# EAGLE design meteo_stm (EAGLE 6.4)
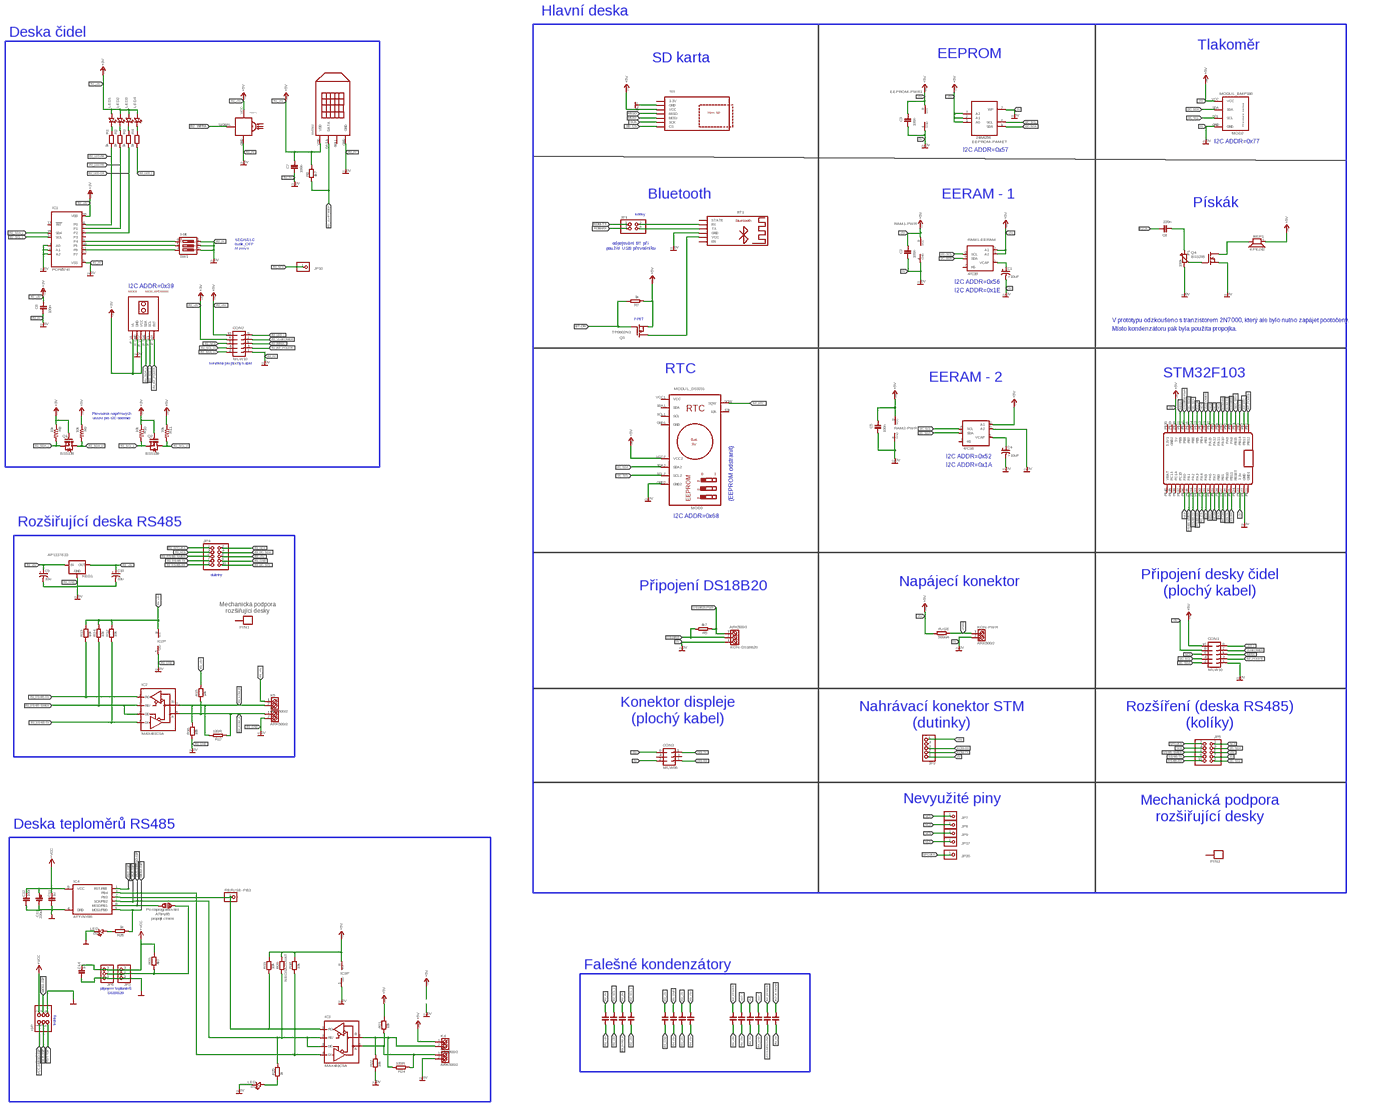
[diagram p0: schematic, sheet 1, overview]
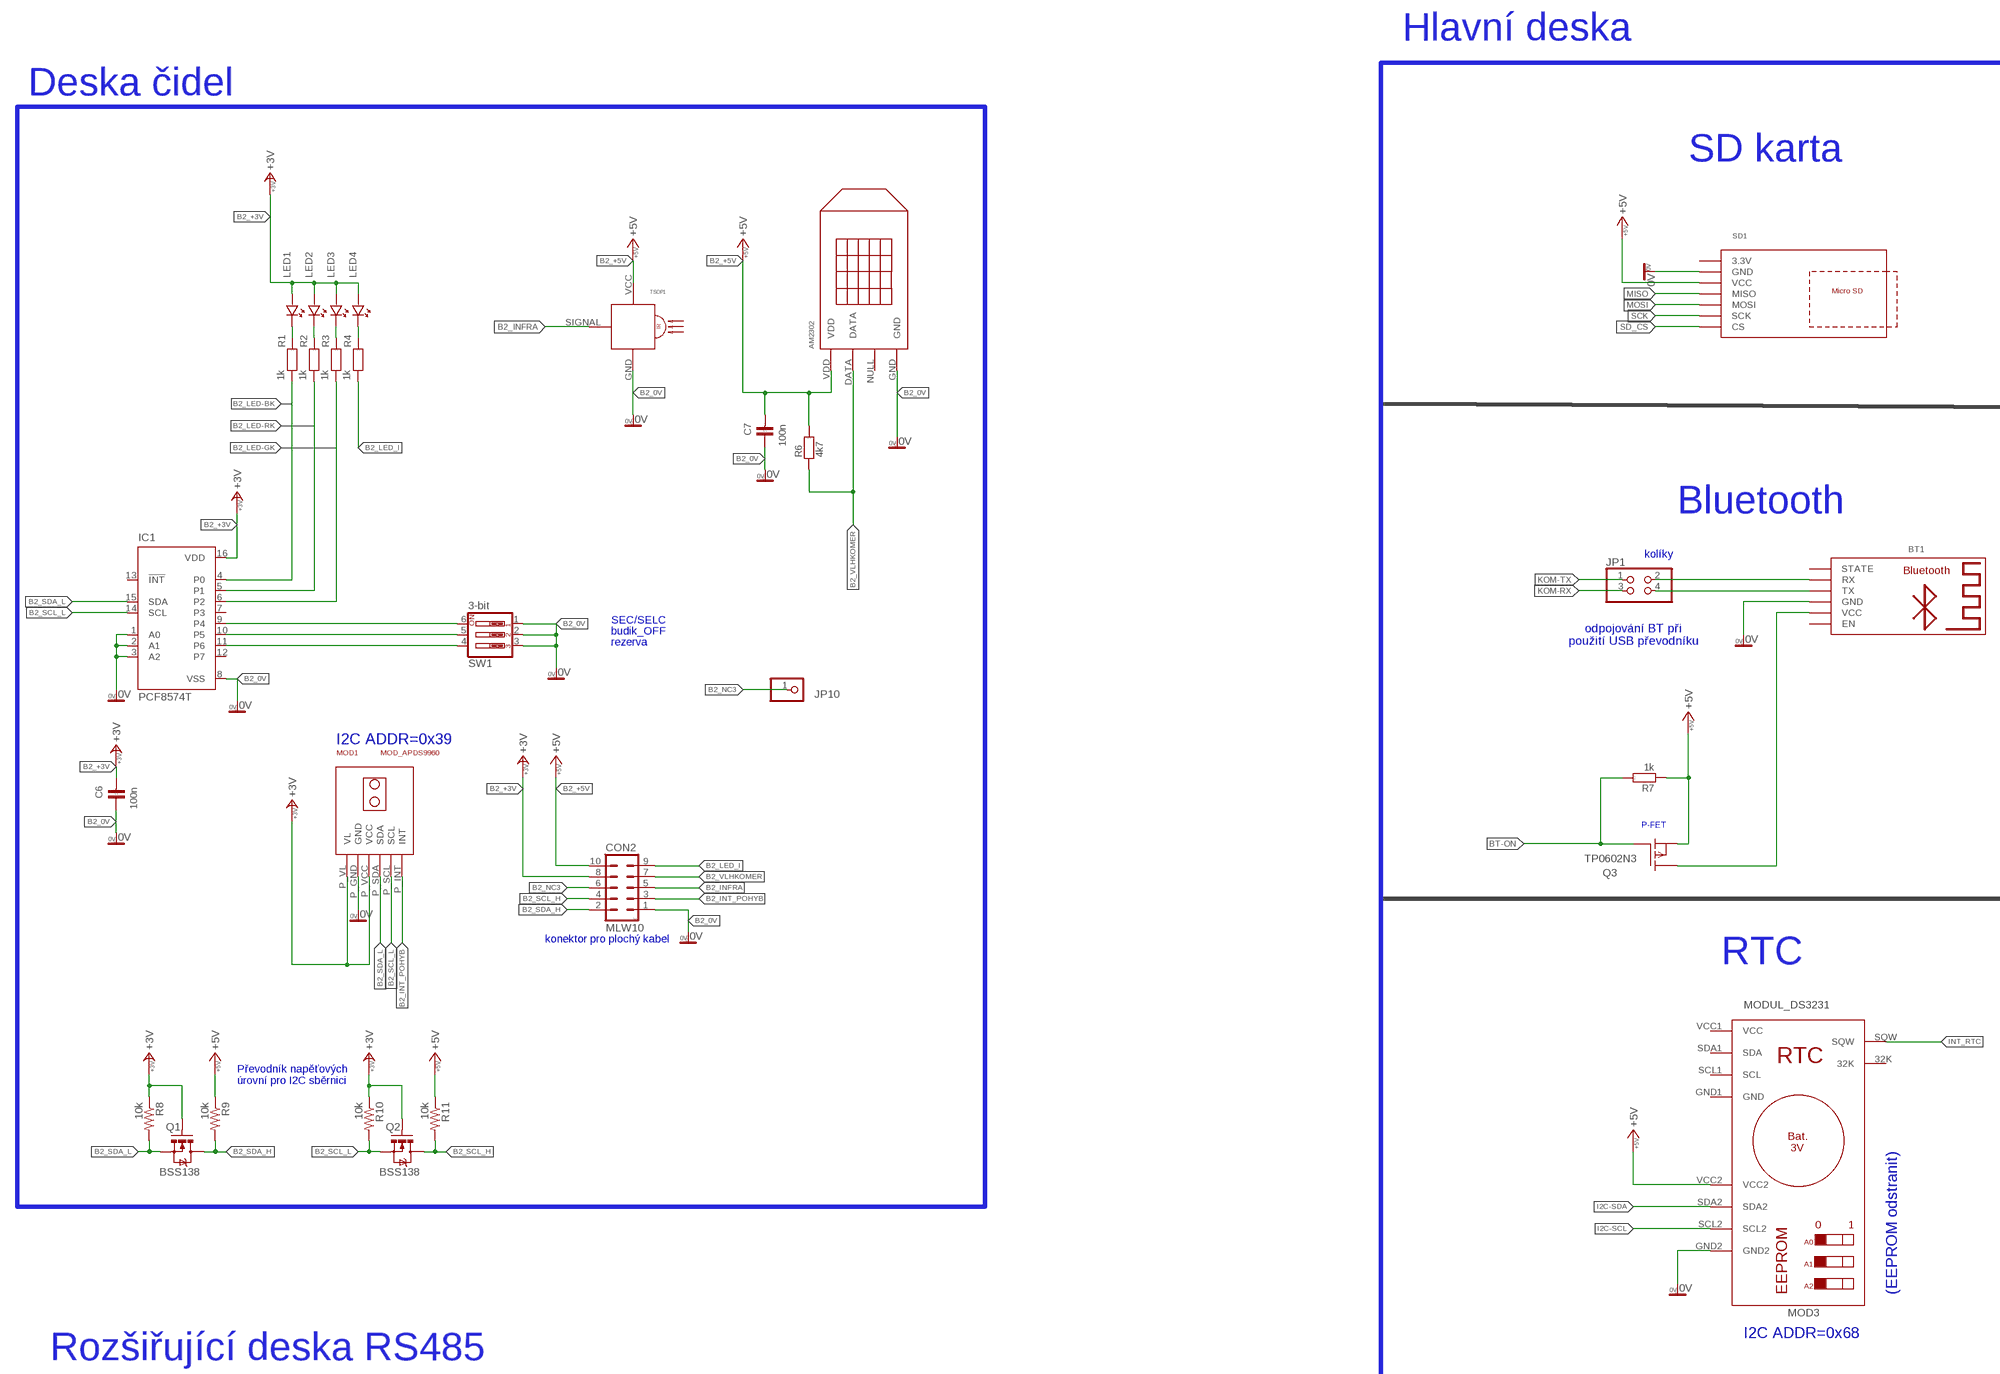
[diagram p1: schematic, sheet 1, part 1 of 4]
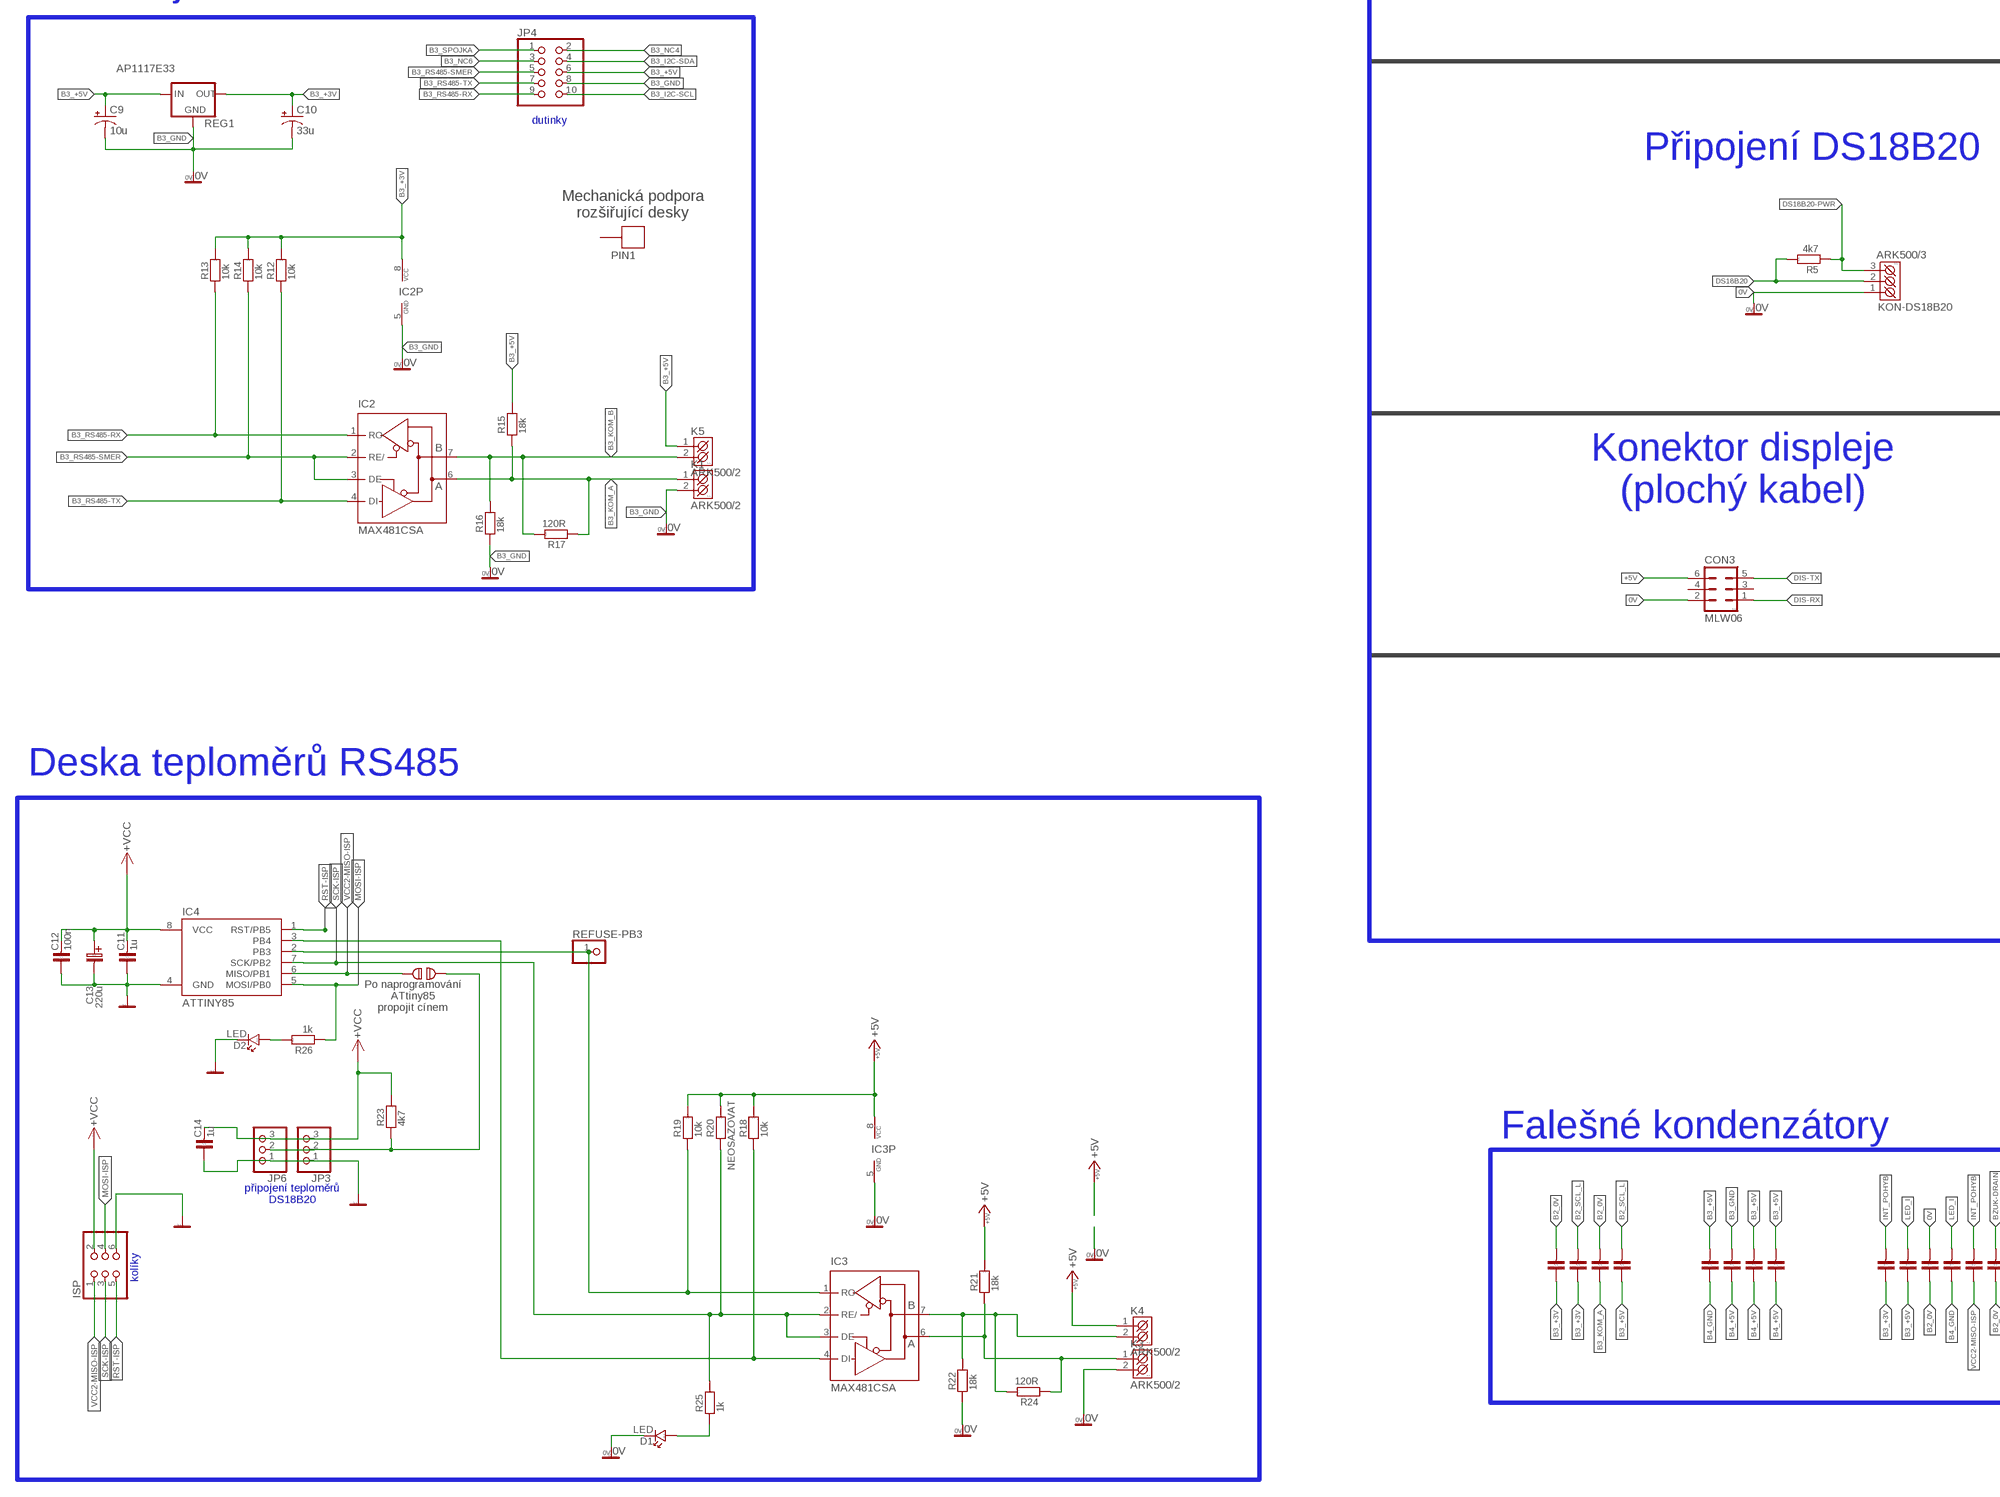
[diagram p2: schematic, sheet 1, part 2 of 4]
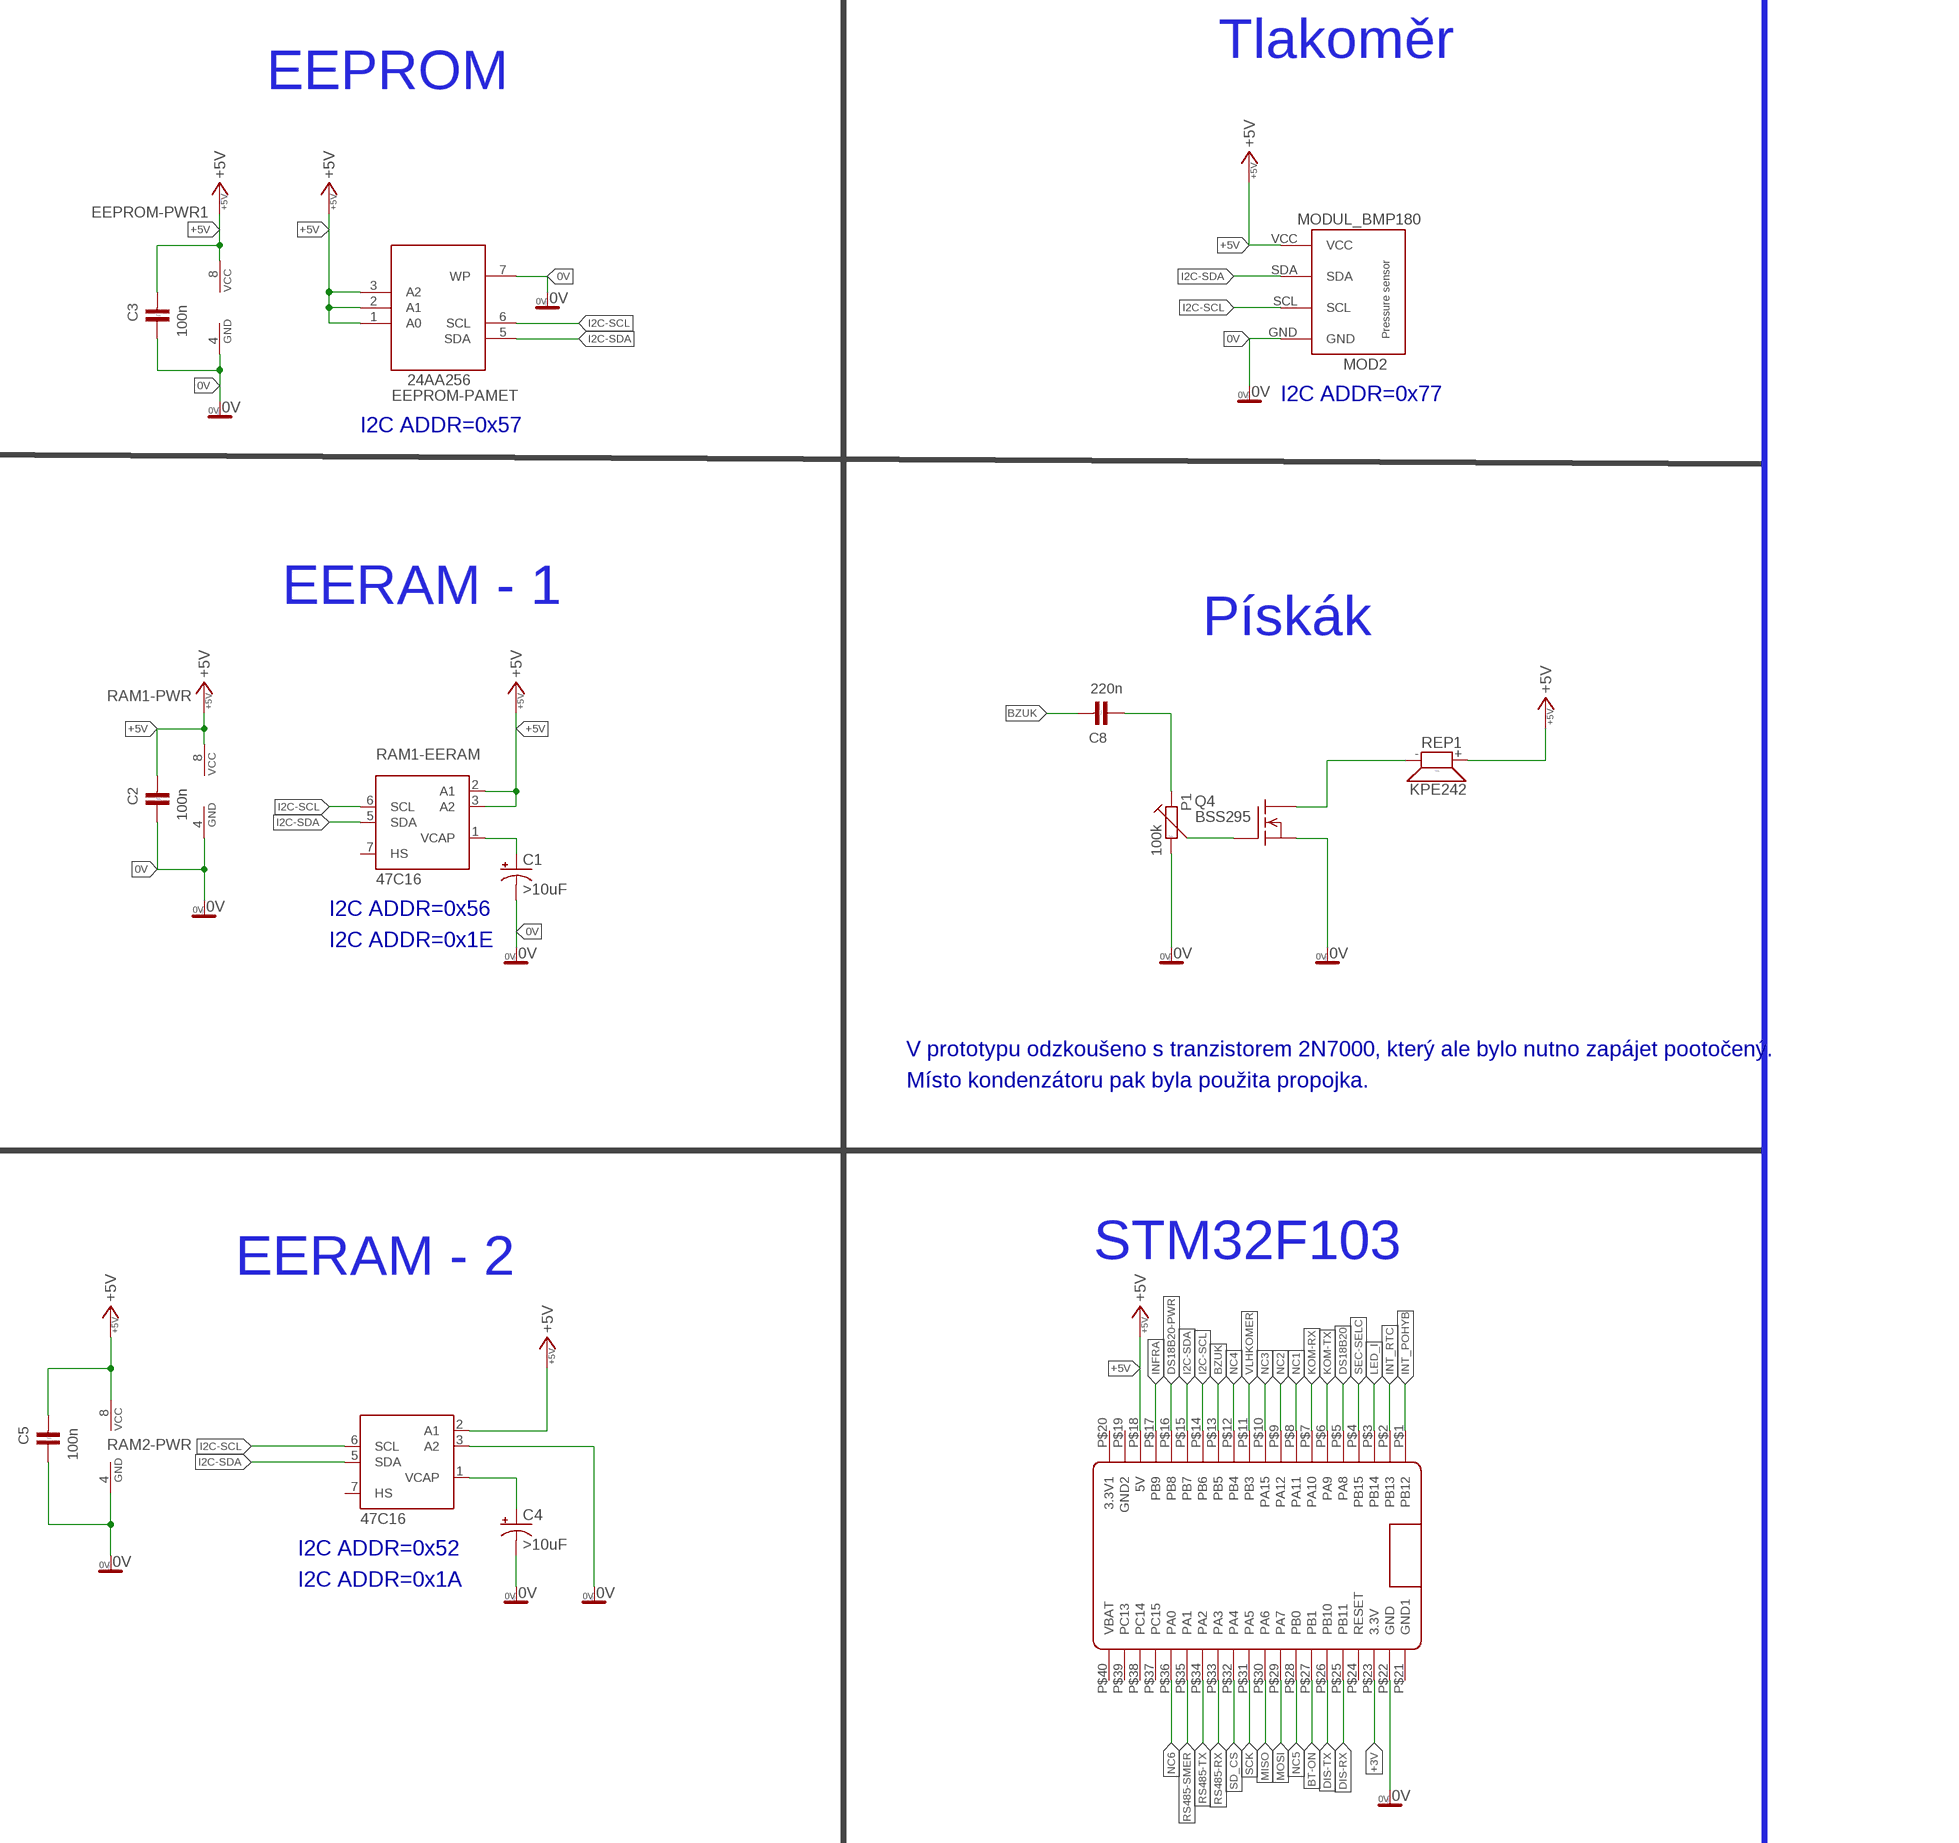
[diagram p3: schematic, sheet 1, part 3 of 4]
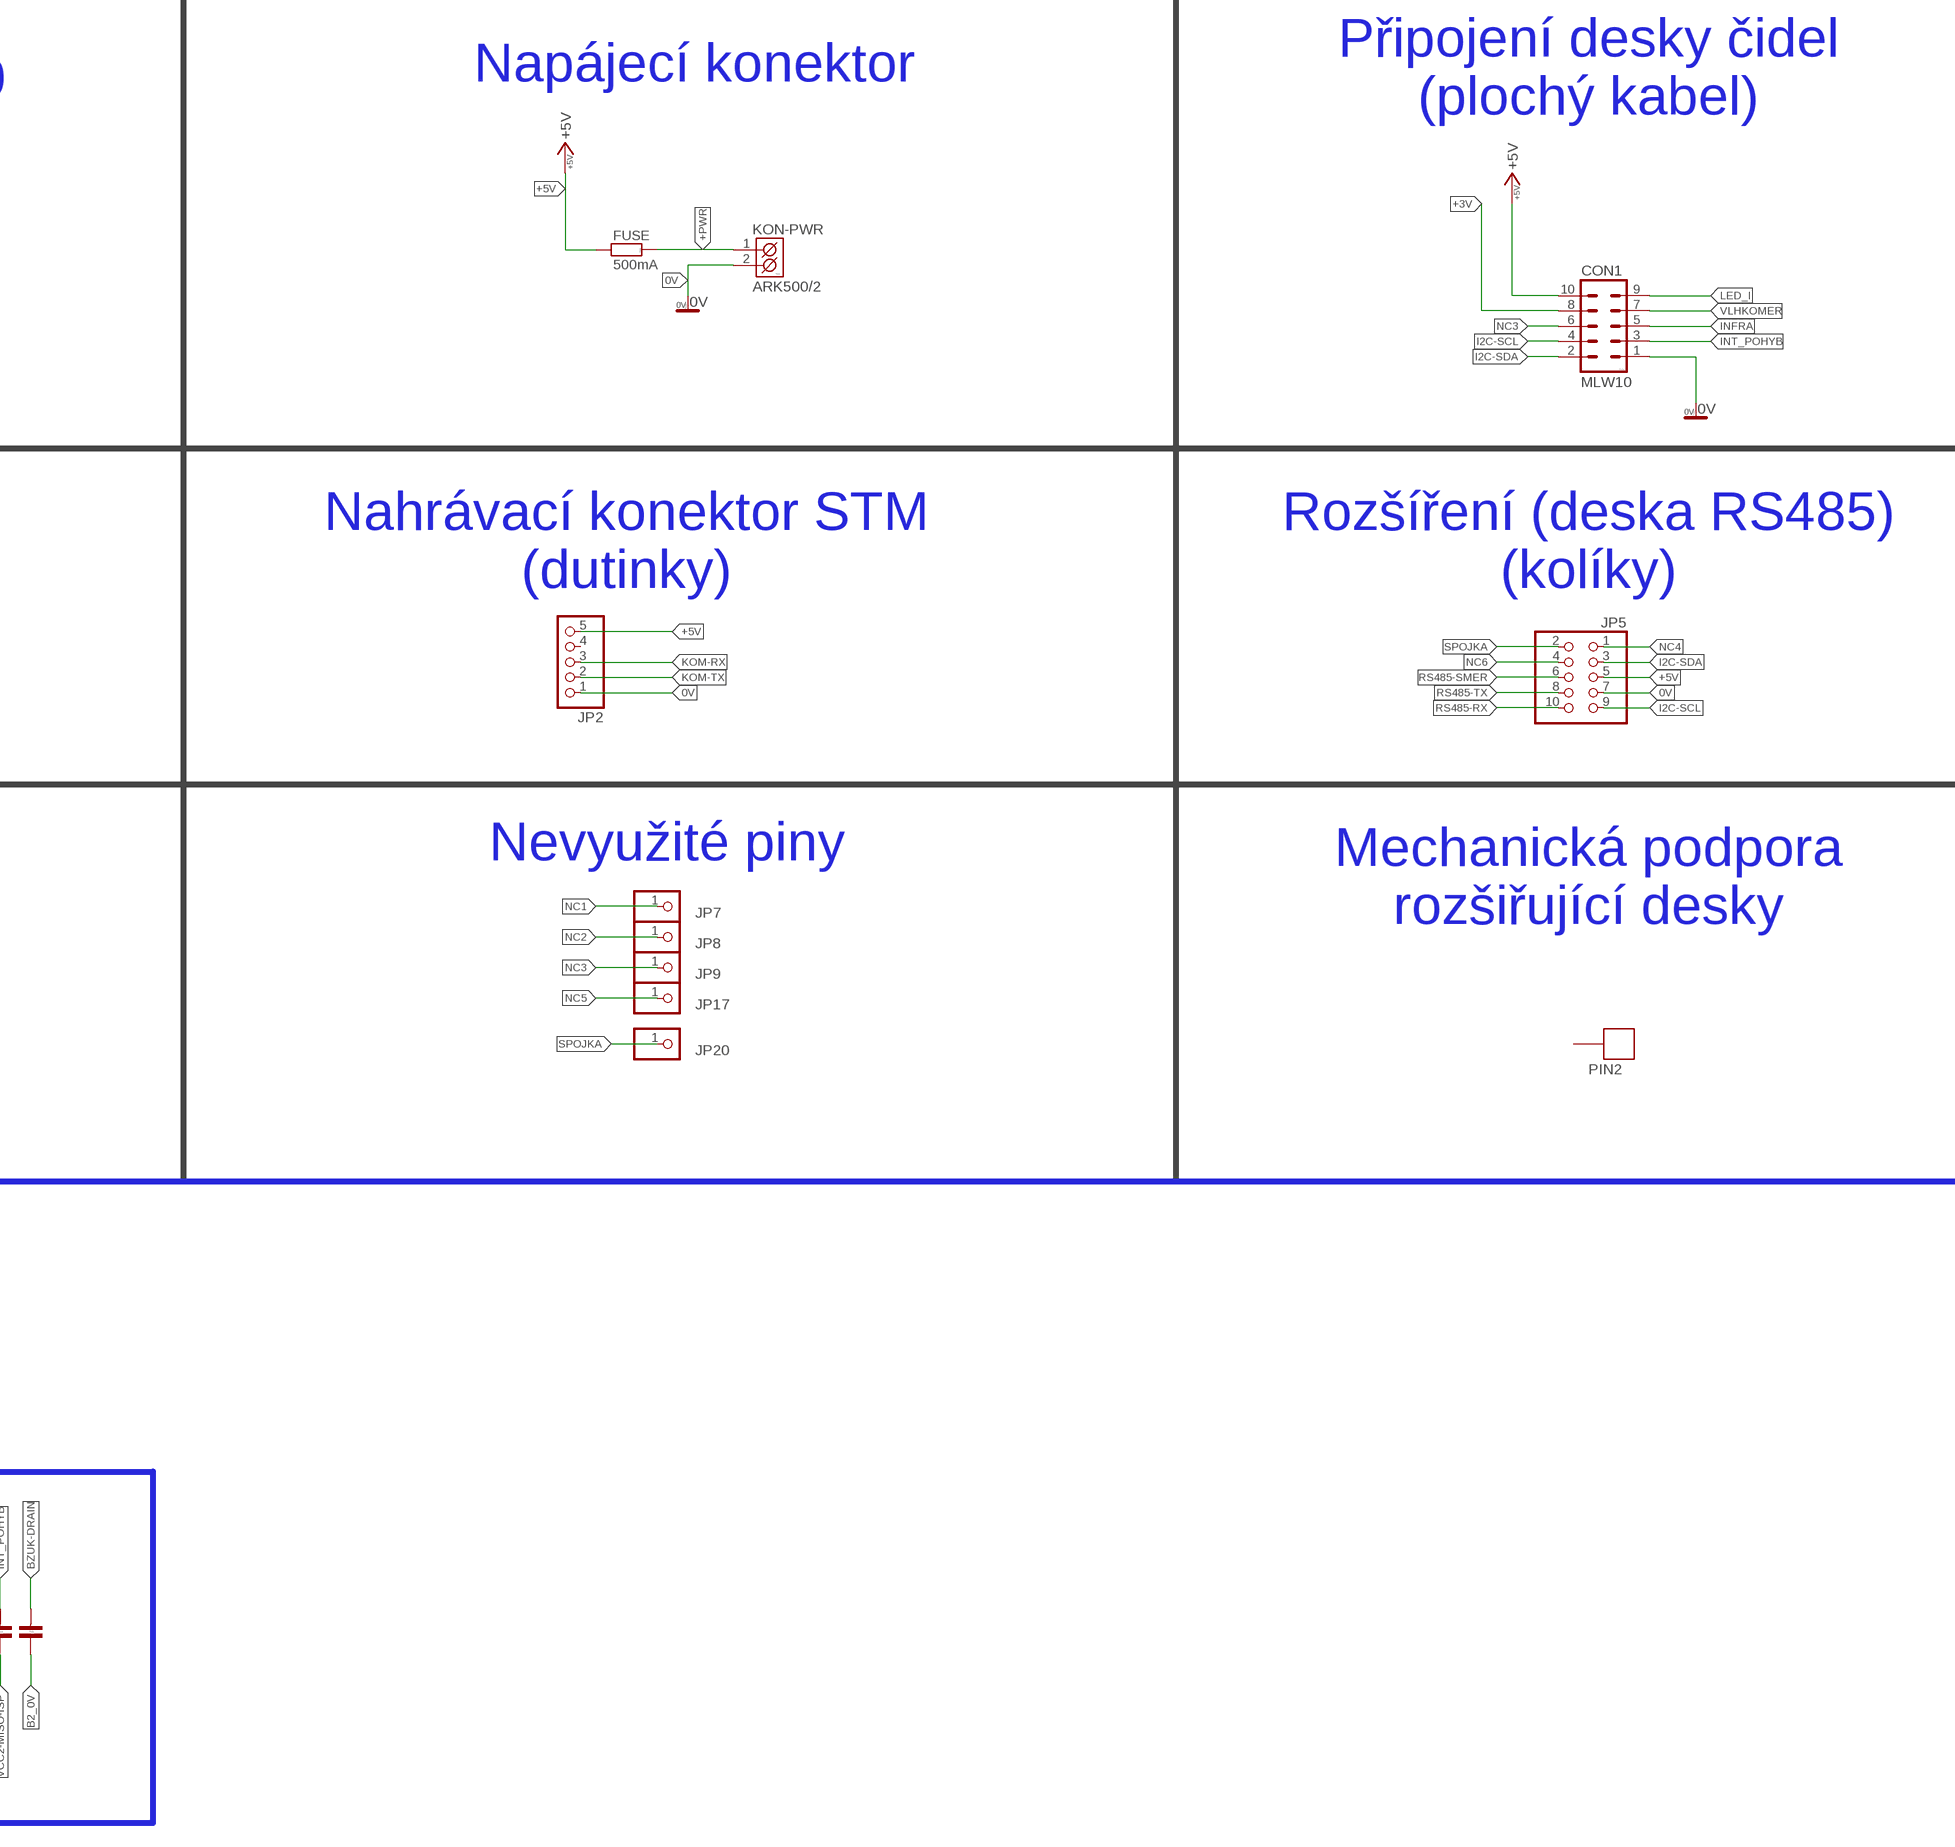
[diagram p4: schematic, sheet 1, part 4 of 4]

## Parts
AM2302  RHT03_DHT-22_AM2302RA  [RHT03_DHT-22/RA]
BT1  BT_MODUL  [BT_MODUL]
C1  >10uF  10UF-POLAR-RADIAL-2.5MM-25V-20%  [CPOL-RADIAL-2.5MM-5MM]
C2  100n  C-KERAMIK_SMD_0805  [0805]
C3  100n  C-KERAMIK_SMD_0805  [0805]
C4  >10uF  10UF-POLAR-RADIAL-2.5MM-25V-20%  [CPOL-RADIAL-2.5MM-5MM]
C5  100n  C-KERAMIK_SMD_0805  [0805]
C6  100n  C-KERAMIK_SMD_0805  [0805]
C7  100n  C-KERAMIK_SMD_0805  [0805]
C8  220n  C-KERAMIK_SMD_0805  [0805]
C9  10u  10UF-POLAR-RADIAL-2.5MM-25V-20%  [CPOL-RADIAL-2.5MM-5MM]
C10  33u  10UF-POLAR-RADIAL-2.5MM-25V-20%  [CPOL-RADIAL-2.5MM-5MM]
C11  1u  C-KERAMIK_SMD_0805  [0805]
C12  100n  C-KERAMIK_SMD_0805  [0805]
C13  220u  C-ELEKTROLYT_3,5  [C-EL_3,5]
C14  1u  C-KERAMIK_SMD_0805  [0805]
C15  ---  C-KERAMIK_SMD_0805  [0805]
C16  ---  C-KERAMIK_SMD_0805  [0805]
C17  ---  C-KERAMIK_SMD_0805  [0805]
C18  ---  C-KERAMIK_SMD_0805  [0805]
C19  ---  C-KERAMIK_SMD_0805  [0805]
C20  ---  C-KERAMIK_SMD_0805  [0805]
C21  ---  C-KERAMIK_SMD_0805  [0805]
C22  ---  C-KERAMIK_SMD_0805  [0805]
C23  ---  C-KERAMIK_SMD_0805  [0805]
C24  ---  C-KERAMIK_SMD_0805  [0805]
C25  ---  C-KERAMIK_SMD_0805  [0805]
C26  ---  C-KERAMIK_SMD_0805  [0805]
C27  ---  C-KERAMIK_SMD_0805  [0805]
C28  ---  C-KERAMIK_SMD_0805  [0805]
CON1  MLW10  [MLW10G]
CON2  MLW10  [MLW10G]
CON3  MLW06  [MLW06G]
D1  LED  LED_SMD_1206  [P1206]
D2  LED  LED_SMD_1206  [P1206]
EEPROM  24AA256  EEPROM  [SO8]
FUSE  500mA  R_SMD_1206  [1206]
IC1  PCF8574T  [SO16W]
IC2  MAX481CSA  [SO08]
IC3  MAX481CSA  [SO08]
IC4  ATTINY85  ATTINY85SU  [ATTINY85]
ISP  PINHD-2X3  [2X03]
JP1  PINHD-2X2  [2X02]
JP2  PINHD-1X5  [1X05]
JP3  PINHD-1X3  [1X03]
JP4  PINHD-2X5  [2X05]
JP5  PINHD-2X5  [2X05]
JP6  PINHD-1X3  [1X03]
JP7  PINHD-1X1  [1X01]
JP8  PINHD-1X1  [1X01]
JP9  PINHD-1X1  [1X01]
JP10  PINHD-1X1  [1X01]
JP17  PINHD-1X1  [1X01]
JP20  PINHD-1X1  [1X01]
K1  ARK500/2  [ARK500/2]
K3  ARK500/2  [ARK500/2]
K4  ARK500/2  [ARK500/2]
K5  ARK500/2  [ARK500/2]
KON-DS18B20  ARK500/3  [ARK500/3]
KON-PWR  ARK500/2  [ARK500/2]
LED1  Modra  LED_3  [LED_3]
LED2  Cervena  LED_3  [LED_3]
LED3  Zelena  LED_3  [LED_3]
LED4  Bila  LED_3  [LED_3]
MOD1  MOD_APDS9960  [MOD_APDS9960]
MOD2  MODUL_BMP180  [MODUL_BMP180]
MOD3  MODUL_DS3231  [DS3231]
P1  100k  TRIMR64Y  [64Y]
PIN1  BIGPIN  [BIGPIN]
PIN2  BIGPIN  [BIGPIN]
Q1  BSS138  MOSFET-NCHANNELSMD  [SOT23-3]
Q2  BSS138  MOSFET-NCHANNELSMD  [SOT23-3]
Q3  TP0602N3  [TO-92]
Q4  BSS295  [TO92]
R1  1k  R_SMD_0805  [0805]
R2  1k  R_SMD_0805  [0805]
R3  1k  R_SMD_0805  [0805]
R4  1k  R_SMD_0805  [0805]
R5  4k7  R_SMD_0805  [0805]
R6  4k7  R_SMD_0805  [0805]
R7  1k  R_SMD_0805  [0805]
R8  10k  RESISTOR0805-RES  [0805]
R9  10k  RESISTOR0805-RES  [0805]
R10  10k  RESISTOR0805-RES  [0805]
R11  10k  RESISTOR0805-RES  [0805]
R12  10k  R_SMD_0805  [0805]
R13  10k  R_SMD_0805  [0805]
R14  10k  R_SMD_0805  [0805]
R15  18k  R_SMD_0805  [0805]
R16  18k  R_SMD_0805  [0805]
R17  120R  R_SMD_0805  [0805]
R18  10k  R_SMD_0805  [0805]
R19  10k  R_SMD_0805  [0805]
R20  NEOSAZOVAT  R_SMD_0805  [0805]
R21  18k  R_SMD_0805  [0805]
R22  18k  R_SMD_0805  [0805]
R23  4k7  R_SMD_0805  [0805]
R24  120R  R_SMD_0805  [0805]
R25  1k  R_SMD_0805  [0805]
R26  1k  R_SMD_0805  [0805]
RAM1  47C16  PCA8581CT  [SO08]
RAM2  47C16  PCA8581CT  [SO08]
REFUSE-PB3  PINHD-1X1  [1X01]
REG1  AP1117E33  V_REG_LD1117VXXLD1117-SMD  [SOT223]
REP1  KPE242  [KPE242]
SD1  MICROSD_MODUL  [MICROSD_MODUL]
SJ-SCL1  SJ  SOLDERJUMPER  [SJ_2S-NO]
SW1  3-bit  SW_DIP-3  [EDG-03]
TSOP1  TSOP  [TSOP]
U$1  BLUE_PILL  [BLUE_PILL]

## Nets
0V: BT1.GND C1.2(-) C2.1 C3.1 C4.2(-) C5.1 C24.2 CON1.1 CON3.2 EEPROM.4(-PWR1:GND) EEPROM.7(-PAMET:WP) JP2.1 JP5.7 KON-DS18B20.1(K1) KON-PWR.2(K2) MOD2.GND MOD3.GND2 P1.2 Q4.3(S) RAM1.4(-PWR:GND) RAM2.3(-EERAM:A2) RAM2.4(-PWR:GND) SD1.GND U$1.P$22(GND)
+3V: CON1.8 U$1.P$23(3.3V)
+5V: C2.2 C3.2 C5.2 CON1.10 CON3.6 EEPROM.1(-PAMET:A0) EEPROM.2(-PAMET:A1) EEPROM.3(-PAMET:A2) EEPROM.8(-PWR1:VCC) FUSE.1 JP2.5 JP5.5 MOD2.VCC MOD3.VCC2 Q3.1(S) R7.1 RAM1.2(-EERAM:A1) RAM1.3(-EERAM:A2) RAM1.8(-PWR:VCC) RAM2.2(-EERAM:A1) RAM2.8(-PWR:VCC) REP1.+ SD1.VCC U$1.P$18(5V)
+PWR: FUSE.2 KON-PWR.1(K1)
B2_0V: AM2302.GND C6.1 C7.1 C15.2 C22.2 C24.1 C28.1 CON2.1 IC1.1(A0) IC1.2(A1) IC1.3(A2) IC1.8(VSS) MOD1.P_GND(GND) SW1.1 SW1.2 SW1.3 TSOP1.GND ; supply symbol labelled 0V
B2_+3V: C6.2 CON2.8 IC1.16(VDD) LED1.A LED2.A LED3.A LED4.A MOD1.P_VCC(VCC) MOD1.P_VL(VL) Q1.1(G) Q2.1(G) R8.1 R10.1 ; supply symbol labelled +3V
B2_+5V: AM2302.VDD C7.2 CON2.10 R6.2 R9.1 R11.1 TSOP1.VCC ; supply symbol labelled +5V
B2_INFRA: CON2.5 TSOP1.SIGNAL
B2_INT_POHYB: CON2.3 MOD1.P_INT(INT)
B2_LED-BK: IC1.4(P0) R1.1
B2_LED-GK: IC1.6(P2) R3.1
B2_LED-RK: IC1.5(P1) R2.1
B2_LED_I: CON2.9 R4.1
B2_NC3: CON2.6 JP10.1
B2_SCL_H: CON2.4 Q2.3(D) R11.2
B2_SCL_L: C16.2 C18.2 IC1.14(SCL) MOD1.P_SCL(SCL) Q2.2(S) R10.2
B2_SDA_H: CON2.2 Q1.3(D) R9.2
B2_SDA_L: IC1.15(SDA) MOD1.P_SDA(SDA) Q1.2(S) R8.2
B2_VLHKOMER: AM2302.DATA CON2.7 R6.1
B3_+3V: C10.1(+) C18.1 C21.1 C22.1 IC2.8(VCC) R12.2 R13.2 R14.2 REG1.2(OUT)
B3_+5V: C9.1(+) C16.1 C17.2 C20.2 C23.2 C25.1 JP4.6 K5.1(K1) R15.2 REG1.3(IN)
B3_GND: C9.2(-) C10.2(-) C19.2 IC2.5(GND) JP4.8 K1.2(K2) R16.1 REG1.1(GND) ; supply symbol labelled 0V
B3_I2C-SCL: JP4.10
B3_I2C-SDA: JP4.4
B3_KOM_A: C15.1 IC2.6(A) K1.1(K1) R15.1 R17.1
B3_KOM_B: IC2.7(B) K5.2(K2) R16.2 R17.2
B3_NC4: JP4.2
B3_NC6: JP4.3
B3_RS485-RX: IC2.1(RO) JP4.9 R13.1
B3_RS485-SMER: IC2.2(RE/) IC2.3(DE) JP4.5 R14.1
B3_RS485-TX: IC2.4(DI) JP4.7 R12.1
B3_SPOJKA: JP4.1
B4_+5V: C11.2 C12.2 C13.C+(C_EL+) C14.2 C19.1 C20.1 C23.1 IC3.8(VCC) IC4.8(VCC) ISP.2 JP3.3 JP6.3 K4.1(K1) R18.2 R19.2 R20.2 R21.2 R23.2 ; supply symbol labelled +5V, +VCC
B4_A: IC3.6(A) K3.1(K1) R21.1 R24.1
B4_B: IC3.7(B) K4.2(K2) R22.2 R24.2
B4_GND: C11.1 C12.1 C13.C-(C_EL-) C14.1 C17.1 C26.1 D1.K D2.K IC3.5(GND) IC4.4(GND) ISP.6 JP3.1 JP6.1 K3.2(K2) R22.1 ; supply symbol labelled GND, 0V
BLUE-RX: BT1.RX JP1.2
BLUE-TX: BT1.TX JP1.4
BT-ON: Q3.2(G) R7.2 U$1.P$27(PB1)
BT-PWR: BT1.VCC Q3.3(D)
BZUK: C8.2 U$1.P$13(PB5)
BZUK-C: C8.1 P1.1
BZUK-DRAIN: C28.2 Q4.2(D) REP1.-
BZUK-GATE: P1.3 Q4.1(G)
DIS-RX: CON3.1 U$1.P$25(PB11)
DIS-TX: CON3.5 U$1.P$26(PB10)
DS18B20: KON-DS18B20.2(K2) R5.2 U$1.P$5(PA8)
DS18B20-PWR: KON-DS18B20.3(K3) R5.1 U$1.P$16(PB8)
I2C-SCL: CON1.4 EEPROM.6(-PAMET:SCL) JP5.9 MOD2.SCL MOD3.SCL2 RAM1.6(-EERAM:SCL) RAM2.6(-EERAM:SCL) U$1.P$14(PB6)
I2C-SDA: CON1.2 EEPROM.5(-PAMET:SDA) JP5.3 MOD2.SDA MOD3.SDA2 RAM1.5(-EERAM:SDA) RAM2.5(-EERAM:SDA) U$1.P$15(PB7)
INFRA: CON1.5 U$1.P$17(PB9)
INT_POHYB: C21.2 C27.2 CON1.3 U$1.P$1(PB12)
INT_RTC: MOD3.SQW U$1.P$2(PB13)
KOM-RX: JP1.3 JP2.3 U$1.P$7(PA10)
KOM-TX: JP1.1 JP2.2 U$1.P$6(PA9)
LED_I: C25.2 C26.2 CON1.9 U$1.P$3(PB14)
MISO: SD1.MISO U$1.P$30(PA6)
MOSI: SD1.MOSI U$1.P$29(PA7)
MOSI-ISP: IC4.5(MOSI/PB0) ISP.4 R26.1
N$1: LED1.K R1.2
N$2: LED2.K R2.2
N$3: LED3.K R3.2
N$5: LED4.K R4.2
N$6: D2.A R26.2
N$7: IC1.11(P6) SW1.4
N$8: C4.1(+) RAM2.1(-EERAM:VCAP)
N$9: IC1.10(P5) SW1.5
N$10: IC1.9(P4) SW1.6
N$12: JP3.2 JP6.2 R23.1 SJ-SCL1.2
N$13: D1.A R25.1
N$17: C1.1(+) RAM1.1(-EERAM:VCAP)
NC1: JP7.1 U$1.P$8(PA11)
NC2: JP8.1 U$1.P$9(PA12)
NC3: CON1.6 JP9.1 U$1.P$10(PA15)
NC4: JP5.1 U$1.P$12(PB4)
NC5: JP17.1 U$1.P$28(PB0)
NC6: JP5.4 U$1.P$36(PA0)
RS485-RX: JP5.10 U$1.P$33(PA3)
RS485-SMER: JP5.6 U$1.P$35(PA1)
RS485-TX: JP5.8 U$1.P$34(PA2)
RST-ISP: IC4.1(RST/PB5) ISP.5
SCK: SD1.SCK U$1.P$31(PA5)
SCK-ISP: IC3.2(RE/) IC3.3(DE) IC4.7(SCK/PB2) ISP.3 R20.1 R25.2
SD_CS: SD1.CS U$1.P$32(PA4)
SEC-SELC: U$1.P$4(PB15)
SPOJKA: JP5.2 JP20.1
TINY-PB4: IC3.4(DI) IC4.3(PB4) R18.1
TL1: IC3.1(RO) IC4.2(PB3) R19.1 REFUSE-PB3.1
VCC2-MISO-ISP: C27.1 IC4.6(MISO/PB1) ISP.1 SJ-SCL1.1
VLHKOMER: CON1.7 U$1.P$11(PB3)
Unconnected: AM2302.NULL BT1.EN BT1.STATE CON3.3 CON3.4 IC1.7(P3) IC1.12(P7) IC1.13(!INT) JP2.4 MOD3.32K MOD3.GND1(GND) MOD3.SCL1(SCL) MOD3.SDA1(SDA) MOD3.VCC1(VCC) PIN1.P$1 PIN2.P$1 RAM1.7(-EERAM:HS) RAM2.7(-EERAM:HS) U$1.P$19(GND2) U$1.P$20(3.3V1) U$1.P$24(RESET) U$1.P$37(PC15) U$1.P$38(PC14) U$1.P$39(PC13) U$1.P$40(VBAT)

## Notes on the sheet
- Hlavní deska
- Deska čidel
- Tlakoměr
- SD karta | EEPROM
- I2C ADDR=0x77
- I2C ADDR=0x57
- Bluetooth | EERAM - 1
- Pískák
- kolíky
- SEC/SELC
- budik_OFF
- odpojování BT při
  použití USB převodníku
- rezerva
- I2C ADDR=0x56
- I2C ADDR=0x39
- I2C ADDR=0x1E
- P-FET
- V prototypu odzkoušeno s tranzistorem 2N7000, který ale bylo nutno zapájet pootočený.
- Místo kondenzátoru pak byla použita propojka.
- konektor pro plochý kabel
- RTC | STM32F103
- EERAM - 2
- Převodník napěťových
  úrovní pro I2C sběrnici
- I2C ADDR=0x52
- I2C ADDR=0x1A
- (EEPROM odstranit)
- I2C ADDR=0x68
- Rozšiřující deska RS485
- dutinky
- Připojení desky čidel
  (plochý kabel)
- Připojení DS18B20 | Napájecí konektor
- Mechanická podpora
  rozšiřující desky
- Konektor displeje
  (plochý kabel)
- Nahrávací konektor STM
  (dutinky)
- Rozšíření (deska RS485)
  (kolíky)
- Nevyužité piny
- Mechanická podpora
  rozšiřující desky
- Deska teploměrů RS485
- Po naprogramování
  ATtiny85
  propojit cínem
- Falešné kondenzátory
- připojení teploměrů
  DS18B20
- kolíky

## Power pins joined to a net without a drawn wire
3.3V: SD1.3,3(3.3V)
GND1: U$1.P$21(GND1)

## Library data of the parts
AM2302 = RHT03_DHT-22_AM2302:RHT03_DHT-22_AM2302: RHT03 / DHT-22 / AM2302 Packages and symbol for the RHT03 / DHT-22 relative humidity and temperature sensor. Note: The AM2302 is a wired version of the DHT-22 which typically requires less clearance and is thus provided as a separate package.; PROD_ID: SEN-10167
BT1 = BT_modul:BT_MODUL: BT modul
C1 C4 C9 C10 = SparkFun-Capacitors:10UF-POLAR: 10.0µF polarized capacitors A capacitor is a passive two-terminal electrical component used to store electrical energy temporarily in an electric field.; PROD_ID: CAP-08440; VALUE: 10uF
C2 C3 C5-C8 C11 C12 C14-C28 = #PaJa_30:C-KERAMIK: Kondenzator - keramicky
C13 = #PaJa_30:C-ELEKTROLYT: Kondenzator - elektrolyticky
CON1 CON2 = #PaJa_konektory:MLW10: Konektory MLW - vidlice - 10x
CON3 = #PaJa_konektory:MLW06: Konektory MLW - vidlice - 6x
D1 D2 LED1-LED4 = #PaJa_30:LED: LED - jednobarevna
EEPROM = eeprom:EEPROM: EEPROM
FUSE R1-R7 R12-R26 = #PaJa_30:R: Rezistor
IC1 = micro-philips:PCF8574: I2C-Bus Remote 8-bit I/O expander http://www.semiconductors.philips.com/acrobat_download/datasheets/PCF8574_4.pdf
IC2 IC3 = maxim:MAX481CSA: RS485 TRANSEIVER; MF: MAXIM; MPN: MAX481CSA; OC_FARNELL: unknown; OC_NEWARK: 90C3817
IC4 = attiny85:ATTINY85: ATMEL ATtiny 85
ISP = pinhead:PINHD-2X3: PIN HEADER
JP1 = pinhead:PINHD-2X2: PIN HEADER
JP2 = pinhead:PINHD-1X5: PIN HEADER
JP3 JP6 = pinhead:PINHD-1X3: PIN HEADER
JP4 JP5 = pinhead:PINHD-2X5: PIN HEADER
JP7-JP10 JP17 JP20 REFUSE-PB3 = pinhead:PINHD-1X1: PIN HEADER
K1 K3-K5 KON-PWR = #PaJa_konektory:ARK500/2: Svorkovnice - roztec 5mm - dvojita
KON-DS18B20 = #PaJa_konektory:ARK500/3: Svorkovnice - roztec 5mm - trojita
MOD1 = mod_APDS9960:MOD_APDS9960: modul APDS9960
MOD2 = modul_bmp180:MODUL_BMP180
MOD3 = modul_DS3231:MODUL_DS3231: Modul DS3231 s externi pameti
P1 = #PaJa_30:TRIMR: Trimr
PIN1 PIN2 = bigpin:BIGPIN: Jeden ovalny pin
Q1 Q2 = SparkFun:MOSFET-NCHANNEL
Q3 = transistor-fet:TP0602N3: P-Channel Enhancement MOSFET -20V; -2A; 2,0Ohm
Q4 = transistor-fet:BSS295: N-Channel Enhancement MOSFET not checked
R8-R11 = SparkFun:RESISTOR: Resistor Basic schematic elements and footprints for 0603, 1206, and PTH resistors.
RAM1 RAM2 = i2c:PCA8581: 2048 x 8-Bit EERAM with I²C Bus Interface
REG1 = SparkFun-IC-Power:V_REG_LD1117VXX: LD1117VXX voltage regulator. We carry the 3.3V version (COM-00526) in TO-220 package.; PROD_ID: VREG-13917
REP1 = #PaJa_30:KPE242: Piezo-sirenka - 70dB - 3V az 16V
SD1 = microSD_modul:MICROSD_MODUL: Modul micro SD karty
SJ-SCL1 = solderjump:SOLDERJUMPER: Pájecí propojka
SW1 = special:SW_DIP-3: DIP SWITCH
TSOP1 = TSOP-infra:TSOP: Infra čidlo TSOP...
U$1 = BluePill:BLUE_PILL

## Board
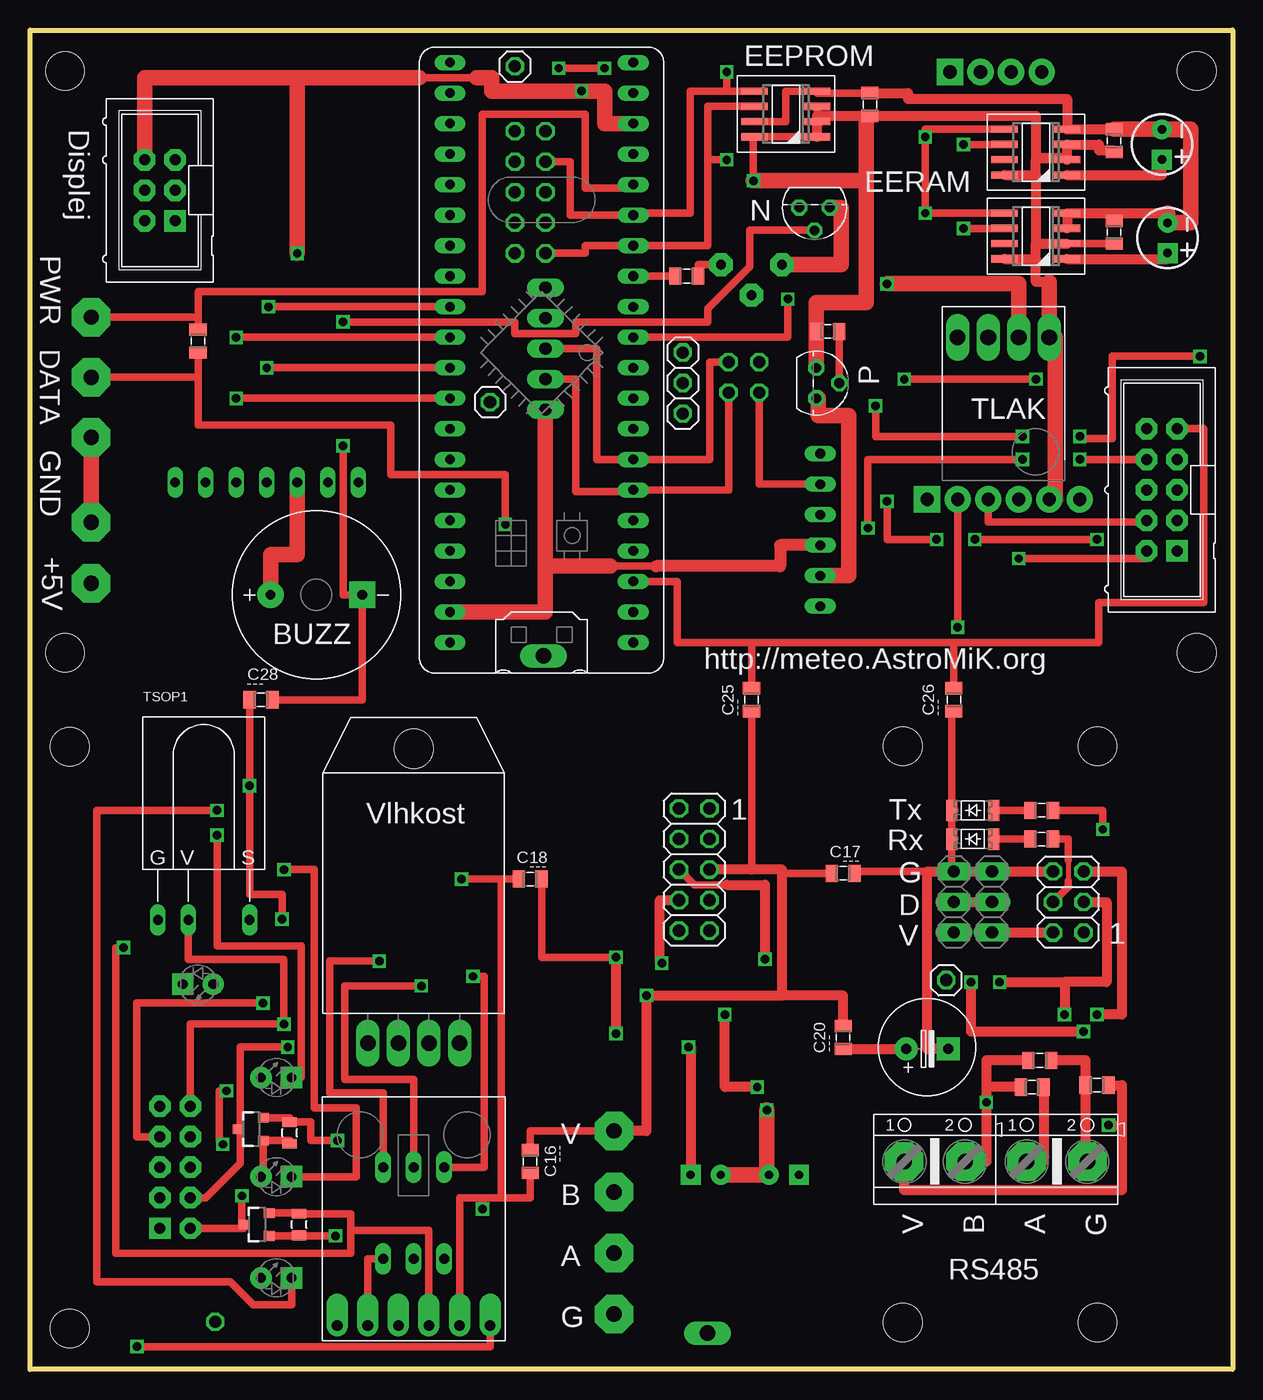
[diagram p5: board, top side]
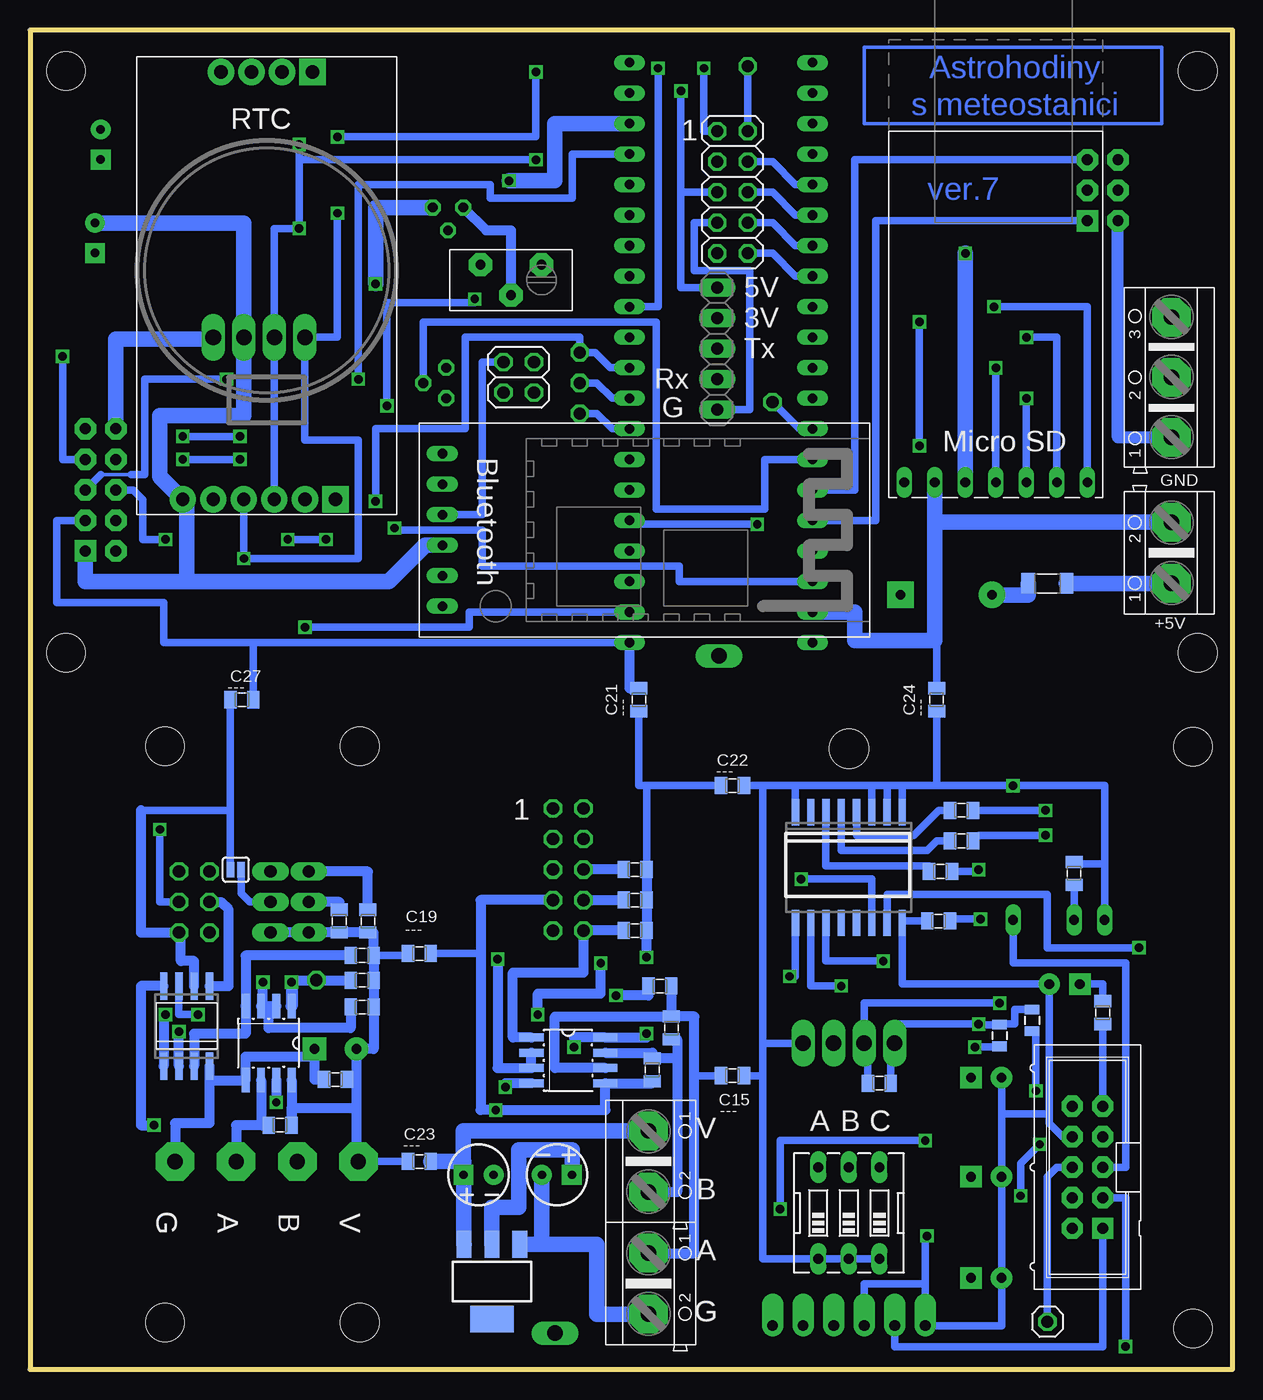
[diagram p6: board, bottom side, seen from below]

Size 100.01 x 111.44 mm. Coordinates in mm from the lower left corner, seen from the top.
Outline: 0,111.44 100.01,111.44 100.01,0 0,0 0,111.44
Copper layers (1*16): Top 0.035mm / dielectric 1.5mm / Bottom 0.035mm
Design rules "default *": minimum track width 10mil, minimum drill 24mil, track to track 8mil, track to pad 8mil, pad to pad 8mil, via to via 8mil, smd to smd 8mil, copper to edge 40mil, drill to drill 8mil, minimum pad ring 10mil, minimum via ring 8mil, stop-mask expansion 4mil, vias tented up to drill 0mil, thermal gap 10mil
Holes 3.2 mm at 2.9,108.05 97.03,108.05 2.9,59.63 97.03,59.63 3.3,3.4 3.3,51.81 72.59,51.85 88.78,51.85 72.59,3.91 88.78,3.91

### Footprints (pad centres in the part's own frame; a part is rotated, then mirrored left to right if it is on the bottom)
RHT03_DHT-22/RA = drill 1.3 pad 1.778 long: DATA -1.27,0; GND 3.81,0; NULL 1.27,0; VDD -3.81,0 | hole 3.25: 0,24.5
BT_MODUL = drill 0.8 long: EN -17.78,-6.985; GND -17.78,-1.905; RX -17.78,3.175; STATE -17.78,5.715; TX -17.78,0.635; VCC -17.78,-4.445
CPOL-RADIAL-2.5MM-5MM = drill 0.7 pad 1.651 square: 1 1.25,0 | drill 0.7 pad 1.651: 2 -1.25,0
0805 = smd 1.016 x 1.422: 1 -0.953,0; 2 0.953,0
C-EL_3,5 = drill 0.813 pad 1.93: C+ 0,0 | drill 0.813 pad 1.93 square: C- 3.493,0
MLW10G = drill 0.914 pad 1.778 square: 1 -5.08,-1.27 | drill 0.914 pad 1.778 octagon: 2 -5.08,1.27; 3 -2.54,-1.27; 4 -2.54,1.27; 5 0,-1.27; 6 0,1.27; 7 2.54,-1.27; 8 2.54,1.27; 9 5.08,-1.27; 10 5.08,1.27
MLW06G = drill 0.914 pad 1.778 square: 1 -2.54,-1.27 | drill 0.914 pad 1.778 octagon: 2 -2.54,1.27; 3 0,-1.27; 4 0,1.27; 5 2.54,-1.27; 6 2.54,1.27
P1206 = smd 0.914 x 1.778: A -1.905,0; K 1.587,0
SO8 = smd 0.6 x 2.2: 1 -1.905,-2.6; 2 -0.635,-2.6; 3 0.635,-2.6; 4 1.905,-2.6; 5 1.905,2.6; 6 0.635,2.6; 7 -0.635,2.6; 8 -1.905,2.6
1206 = smd 1.143 x 1.702: 1 -1.587,0; 2 1.587,0
SO16W = smd 0.6 x 2.2: 1 -4.445,-4.6; 2 -3.175,-4.6; 3 -1.905,-4.6; 4 -0.635,-4.6; 5 0.635,-4.6; 6 1.905,-4.6; 7 3.175,-4.6; 8 4.445,-4.6; 9 4.445,4.6; 10 3.175,4.6; 11 1.905,4.6; 12 0.635,4.6; 13 -0.635,4.6; 14 -1.905,4.6; 15 -3.175,4.6; 16 -4.445,4.6
SO08 = smd 0.66 x 2.032: 1 -1.905,-3.073; 2 -0.635,-3.073; 3 0.635,-3.073; 4 1.905,-3.073; 5 1.905,3.073; 6 0.635,3.073; 7 -0.635,3.073; 8 -1.905,3.073
ATTINY85 = smd 0.6 x 2.286: 1 -1.905,-3.33; 2 -0.635,-3.33; 3 0.635,-3.33; 4 1.905,-3.33; 5 1.905,3.33; 6 0.635,3.33; 7 -0.635,3.33; 8 -1.905,3.33
2X03 = drill 1.016 octagon: 1 -2.54,-1.27; 2 -2.54,1.27; 3 0,-1.27; 4 0,1.27; 5 2.54,-1.27; 6 2.54,1.27
2X02 = drill 1.016 octagon: 1 -1.27,-1.27; 2 -1.27,1.27; 3 1.27,-1.27; 4 1.27,1.27
1X05 = drill 1.016 long: 1 -5.08,0; 2 -2.54,0; 3 0,0; 4 2.54,0; 5 5.08,0
1X03 = drill 1.016 long: 1 -2.54,0; 2 0,0; 3 2.54,0
2X05 = drill 1.016 octagon: 1 -5.08,-1.27; 2 -5.08,1.27; 3 -2.54,-1.27; 4 -2.54,1.27; 5 0,-1.27; 6 0,1.27; 7 2.54,-1.27; 8 2.54,1.27; 9 5.08,-1.27; 10 5.08,1.27
1X01 = drill 1.016 octagon: 1 0,0
ARK500/2 = drill 1.27 pad 3.2 octagon: 1 -2.54,0; 2 2.54,0
ARK500/3 = drill 1.27 pad 3.2 octagon: 1 -5,0; 2 0,0; 3 5,0
LED_3 = drill 0.813 pad 1.778: A -1.27,0 | drill 0.813 pad 1.778 square: K 1.27,0
MOD_APDS9960 = drill 0.9 pad 1.778 offset: P_GND -3.81,-7.62; P_INT 6.35,-7.62; P_SCL 3.81,-7.62; P_SDA 1.27,-7.62; P_VCC -1.27,-7.62; P_VL -6.35,-7.62
MODUL_BMP180 = drill 1.3 pad 1.778 long: GND 1.27,3.81; SCL -1.27,3.81; SDA -3.81,3.81; VCC 3.81,3.81
DS3231 = drill 1.1 pad 2.184 square: 32K 36.83,16.51; SCL1 1.27,14.605 | drill 1.1 pad 2.184: GND1 1.27,6.985; GND2 36.83,3.81; SCL2 36.83,11.43; SDA1 1.27,12.065; SDA2 36.83,8.89; SQW 36.83,13.97; VCC1 1.27,9.525; VCC2 36.83,6.35
64Y = drill 0.813 pad 1.93 octagon: 1 0,2.54; 2 0,-2.54; 3 2.54,0
BIGPIN = drill 1.3 long: P$1 0,0
SOT23-3 = smd 0.8 x 0.9: 1 -0.95,-1; 2 0.95,-1; 3 0,1.1
TO-92 = drill 0.813 octagon: 1 -1.27,0; 2 0,1.905; 3 1.27,0
TO92 = drill 0.813 octagon: 1 1.27,0; 2 0,1.905; 3 -1.27,0
0805' = smd 0.8 x 1.2: 1 -0.9,0; 2 0.9,0
SO08' = smd 0.6 x 2.2: 1 -1.905,-2.6; 2 -0.635,-2.6; 3 0.635,-2.6; 4 1.905,-2.6; 5 1.905,2.6; 6 0.635,2.6; 7 -0.635,2.6; 8 -1.905,2.6
SOT223 = smd 1.219 x 2.235: 1 -2.311,-3.099; 2 0,-3.099; 3 2.311,-3.099 | smd 3.6 x 2.2: 4 0,3.099
KPE242 = drill 0.813 pad 2.184: + -3.81,0 | drill 0.813 pad 2.184 square: - 3.81,0
MICROSD_MODUL = drill 0.8 long: 3,3 -15.24,7.62; CS -15.24,-7.62; GND -15.24,5.08; MISO -15.24,0; MOSI -15.24,-2.54; SCK -15.24,-5.08; VCC -15.24,2.54
SJ_2S-NO = smd 0.635 x 1.27: 1 0,0; 2 0.889,0
EDG-03 = drill 0.813 long: 1 -2.54,-3.81; 2 0,-3.81; 3 2.54,-3.81; 4 2.54,3.81; 5 0,3.81; 6 -2.54,3.81
TSOP = drill 0.8 long: GND -3.81,-9.271; VCC -1.27,-9.271 | drill 0.8 pad 1.27 long: SIGNAL 3.81,-9.271
BLUE_PILL = drill 0.8 long: P$1 -7.62,15.24; P$2 -7.62,12.7; P$3 -7.62,10.16; P$4 -7.62,7.62; P$5 -7.62,5.08; P$6 -7.62,2.54; P$7 -7.62,0; P$8 -7.62,-2.54; P$9 -7.62,-5.08; P$10 -7.62,-7.62; P$11 -7.62,-10.16; P$12 -7.62,-12.7; P$13 -7.62,-15.24; P$14 -7.62,-17.78; P$15 -7.62,-20.32; P$16 -7.62,-22.86; P$17 -7.62,-25.4; P$18 -7.62,-27.94; P$19 -7.62,-30.48; P$20 -7.62,-33.02; P$21 7.62,15.24; P$22 7.62,12.7; P$23 7.62,10.16; P$24 7.62,7.62; P$25 7.62,5.08; P$26 7.62,2.54; P$27 7.62,0; P$28 7.62,-2.54; P$29 7.62,-5.08; P$30 7.62,-7.62; P$31 7.62,-10.16; P$32 7.62,-12.7; P$33 7.62,-15.24; P$34 7.62,-17.78; P$35 7.62,-20.32; P$36 7.62,-22.86; P$37 7.62,-25.4; P$38 7.62,-27.94; P$39 7.62,-30.48; P$40 7.62,-33.02

### Placement (x,y rotation side)
AM2302  31.91,27.15 0 top
BT1  47.94,70.48 0 bottom
C1  94.14,101.92 270 top
C2  69.85,105.25 270 top
C3  90.17,102.23 270 top
C4  94.62,94.14 270 top
C5  90.17,94.61 270 top
C6  24.45,37.31 180 bottom
C7  13.18,41.27 270 bottom
C8  54.61,90.96 180 top
C9  62.71,16.19 180 bottom
C10  56.2,16.19 0 bottom
C11  71.91,37.31 270 bottom
C12  74.61,24.13 0 bottom
C13  72.87,26.67 0 top
C14  88.74,23.65 0 top
C15  41.59,24.45 0 bottom
C16  41.59,17.3 270 top
C17  67.63,41.27 180 top
C18  41.59,40.8 180 top
C19  67.63,34.61 0 bottom
C20  67.63,27.62 90 top
C21  49.37,55.72 90 bottom
C22  41.59,48.58 0 bottom
C23  67.63,17.3 0 bottom
C24  24.61,55.72 90 bottom
C25  60.01,55.72 90 top
C26  76.84,55.72 90 top
C27  82.39,55.72 0 bottom
C28  19.21,55.72 0 top
CON1  94.14,73.18 90 top
CON2  12.07,16.83 90 bottom
CON3  10.79,98.11 90 top
D1  78.26,46.51 180 top
D2  78.26,44.13 180 top
EEPROM  62.87,104.46 90 top
FUSE  15.4,65.41 0 bottom
IC1  31.91,41.75 180 bottom
IC2  55.25,25.72 270 bottom
IC3  80.17,27.15 180 bottom
IC4  87,28.58 0 bottom
ISP  86.36,38.89 90 top
JP1  59.37,82.55 90 bottom
JP2  42.86,84.93 90 bottom
JP3  80.01,38.89 270 top
JP4  55.25,41.59 270 top
JP5  41.59,97.95 270 bottom
JP6  76.84,38.89 270 top
JP7  54.29,79.53 90 top
JP8  54.29,82.07 90 top
JP9  54.29,84.61 90 top
JP10  15.4,3.97 0 bottom
JP17  38.26,80.49 0 top
JP20  40.32,108.43 90 top
K1  48.58,7.14 270 bottom
K3  85.41,17.3 0 top
K4  75.25,17.3 0 top
K5  48.58,17.3 270 bottom
KON-DS18B20  5.08,82.55 90 bottom
KON-PWR  5.08,67.94 90 bottom
LED1  20.48,7.62 0 top
LED2  20.48,24.29 0 top
LED3  20.48,16.03 0 top
LED4  13.97,32.07 180 top
MOD1  31.91,11.27 0 top
MOD2  80.96,82.07 0 top
MOD3  91.12,109.22 270 bottom
P1  60.01,91.92 270 bottom
PIN1  56.36,3.02 0 top
PIN2  42.7,59.37 0 top
Q1  18.89,12.06 90 top
Q2  18.41,20 90 top
Q3  65.41,82.07 270 top
Q4  65.25,96.68 180 top
R1  22.54,46.51 0 bottom
R2  22.54,43.97 0 bottom
R3  24.29,41.43 0 bottom
R4  10.79,29.69 90 bottom
R5  13.97,85.57 270 top
R6  29.37,23.81 0 bottom
R7  66.36,86.36 0 top
R8  10k  [0805']  22.38,12.06 90 top
R9  10k  [0805']  16.67,29.05 270 bottom
R10  10k  [0805']  21.59,19.69 90 top
R11  10k  [0805']  19.37,27.78 270 bottom
R12  49.69,39.05 0 bottom
R13  49.69,36.51 0 bottom
R14  49.69,41.59 0 bottom
R15  47.62,31.91 180 bottom
R16  48.26,24.92 90 bottom
R17  46.67,28.42 270 bottom
R18  72.39,34.45 0 bottom
R19  72.39,32.38 0 bottom
R20  72.39,30.16 0 bottom
R21  79.22,20.32 0 bottom
R22  83.98,25.72 180 top
R23  74.3,37.31 270 bottom
R24  83.34,23.5 180 top
R25  84.14,46.51 0 top
R26  84.14,44.13 180 top
RAM1  47C16  [SO08']  83.66,101.28 90 top
RAM2  47C16  [SO08']  83.66,94.3 90 top
REFUSE-PB3  76.2,32.38 0 top
REG1  61.59,7.3 180 bottom
REP1  23.81,64.45 0 top
SD1  19.68,89.06 90 bottom
SJ-SCL1  83.34,41.59 0 bottom
SW1  31.91,13.02 0 bottom
TSOP1  14.45,46.67 0 top
U$1  42.55,75.72 180 top

### Tracks (layer width: path | path; a pad name or v marks a point on that pad's centre or on a via)
0V  (via drill 0.7)
  Top 0.61: 90.17,96.2 C5.1 | 94.62,95.41 C4.2 | C2.1 65.47,106.2 EEPROM.4 62.87,106.36 62.87,103.82 EEPROM.7 | 52.07,66.83 48.26,66.83
  Top 0.813: C3.1 RAM1.4 86.26,105.73 73.03,105.73 73.03,106.2 C2.1 | RAM2.4 94.62,96.2 | RAM2.4 90.17,96.2 | RAM2.4 RAM2.3
  Top 1.016: BT1.GND 62.39,68.58 62.39,66.83 52.07,66.83
  Top 1.27: 94.62,96.2 C4.2 | C3.1 96.52,103.19 96.52,103.17 | 96.52,103.17 96.52,95.41 94.62,95.41 | KON-PWR.2 KON-DS18B20.1 | JP2.1 42.86,66.83 | 42.86,66.83 42.86,63.02 U$1.P$22 | 48.26,66.83 42.86,66.83 | P1.2 67.47,91.92 67.47,96.68 Q4.3 | v71.28,90.33 82.23,90.33 MOD2.GND | C1.2 96.52,103.17
  Bottom 0.61: JP5.7 44.77,95.41 44.77,91.44 40.16,91.44 40.16,79.85 JP2.1 | C24.2 24.61,63.02 24.77,63.02
  Bottom 1.016: KON-DS18B20.1 9.53,77.55 CON3.2
  Bottom 1.27: KON-PWR.2 24.77,70.48 | 24.77,70.48 SD1.GND | U$1.P$22 31.43,63.02 31.43,60.64 24.77,60.64 24.77,63.02 24.77,70.48 | 87,65.56 87,72.07 MOD3.GND2 89.22,74.29 89.22,79.37 82.23,79.37 MOD2.GND 82.23,95.39 C4.2 | 87,65.56 95.41,65.56 CON1.1 | 87,65.56 70.17,65.56 67.15,68.58 BT1.GND | Q4.3 71.28,96.68 v71.28,90.33
+3V  (via drill 0.7)
  Top 0.61: v69.69,70.01 69.69,75.72 v82.55,75.72 | v87.31,75.72 CON1.8
  Bottom 0.61: U$1.P$23 46.04,65.56 46.04,66.83 62.39,66.83 62.39,69.85 69.69,69.85 v69.69,70.01 | v82.55,75.72 v87.31,75.72
+5V  (via drill 0.7)
  Top 0.61: 88.9,101.92 88.9,101.44 | 90.17,101.44 C3.2 | RAM2.2 C5.2 | RAM1.2 83.66,100.65 | EEPROM.3 EEPROM.2 EEPROM.1 | EEPROM.1 EEPROM.8 | EEPROM.1 60.17,102.55 v60.17,98.9 | 37.15,107.47 32.39,107.47 | 85.25,85.88 MOD2.VCC
  Top 0.813: 88.9,101.92 RAM1.3 86.26,100.81 | 88.9,101.44 90.17,101.44 | RAM1.2 86.26,100.81 | RAM1.8 83.66,99.38 | 83.66,99.38 83.66,100.65 83.66,104.3 C2.2 65.47,104.3 EEPROM.1 | 83.66,100.81 86.26,100.81 | 83.66,99.38 83.66,93.66 | 83.66,93.66 RAM2.2 | RAM2.8 83.66,92.39 | 83.66,92.39 83.66,93.66 | 84.77,90.49 83.66,90.49 83.66,92.39
  Top 1.27: Q3.1 R7.1 65.41,88.74 69.53,88.74 69.53,98.9 | v60.17,98.9 69.53,98.9 | 22.23,107.47 9.53,107.47 CON3.6 | 37.15,107.47 38.42,107.47 38.42,106.36 v45.88,106.36 47.78,106.36 47.78,103.66 U$1.P$18 | 32.39,107.47 22.23,107.47 | MOD2.VCC 84.77,90.49 | v22.23,92.87 22.23,107.47 | MOD3.VCC2 85.25,72.39 85.25,85.88 | SD1.VCC 22.23,67.79 20,67.79 REP1.+ | 69.53,98.9 69.53,103.98
  Bottom 0.61: JP2.5 45.88,90.01 45.88,97.95 | 45.88,97.95 v45.88,106.36 | MOD2.VCC 84.77,85.72 | JP5.5 45.88,97.95
  Bottom 1.27: v60.17,98.9 56.36,98.9 56.36,103.66 U$1.P$18 | 84.77,85.72 92.87,85.72 CON1.10 | SD1.VCC v22.23,92.87 | FUSE.1 16.99,64.45 REP1.+
+PWR
  Bottom 1.27: KON-PWR.1 FUSE.2
B2_0V  (via drill 0.7)
  Top 0.61: SW1.3 28.1,9.21 MOD1.P_GND | v20.96,37.46 20.96,39.53 18.26,39.53 v18.26,48.58 C28.1
  Bottom 0.61: SW1.3 SW1.2 SW1.1 39.05,9.21 39.05,24.45 | CON2.1 10.8,1.9 28.1,1.9 MOD1.P_GND | IC1.8 36.35,48.58 | 36.35,48.58 30,48.58 | IC1.3 30,48.58 | IC1.2 28.73,48.58 | 28.73,48.58 30,48.58 | IC1.1 27.46,48.58 | 27.46,48.58 28.73,48.58 | TSOP1.GND 10.64,42.07 | 10.64,42.07 10.64,48.58 v18.26,48.58 24.61,48.58 | 24.61,48.58 27.46,48.58 | AM2302.GND 39.05,27.15 | 39.05,27.15 39.05,48.58 | 39.05,48.58 36.35,48.58 | 39.05,24.45 39.05,27.15 | C7.1 13.18,42.07 10.64,42.07 | C6.1 23.5,37.46 v20.96,37.46 | 39.05,48.58 C22.2 | C15.2 39.05,24.45 | C24.1 24.61,48.58
B2_+3V  (via drill 0.7)
  Top 0.61: R10.1 21.59,19.05 Q2.1 19.42,16.03 LED3.A | R8.1 22.38,11.11 Q1.1 v25.4,11.11
  Bottom 0.61: MOD1.P_VCC 30.64,7.14 25.56,7.14 | 25.56,7.14 MOD1.P_VL 19.21,3.65 LED1.A LED3.A 19.21,21.27 | LED4.A 27.46,32.07 IC1.16 27.46,37.31 C6.2 | 15.4,32.07 LED4.A | 15.24,21.27 15.24,20.48 14.13,19.37 CON2.8 | 15.24,21.27 19.21,21.27 | LED4.A 15.24,21.27 | v25.4,11.11 25.56,11.11 25.56,7.14 | 19.21,21.27 LED2.A
B2_+5V  (via drill 0.7)
  Top 0.61: CON2.10 13.34,28.73 v21.11,28.73 21.11,34.13 13.18,34.13 TSOP1.VCC
  Bottom 0.61: R6.2 28.42,27.15 AM2302.VDD 28.1,28.73 v21.11,28.73 | C7.2 TSOP1.VCC | 21.11,28.63 v21.11,28.73 | R9.1 18.1,29.95 18.1,28.73 19.37,28.73 R11.1 21.11,28.68 v21.11,28.73
B2_INFRA
  Bottom 0.61: CON2.5 8.89,16.83 8.89,33.81 18.26,33.81 TSOP1.SIGNAL
B2_INT_POHYB  (via drill 0.7)
  Top 0.61: v8.89,1.9 38.26,1.9 MOD1.P_INT
  Bottom 0.61: CON2.3 8.89,14.29 v8.89,1.9
B2_LED-BK
  Bottom 0.61: IC1.4 31.27,44.45 26.51,44.45 24.45,46.51 R1.1
B2_LED-GK
  Bottom 0.61: IC1.6 33.81,41.91 25.24,41.91 R3.1
B2_LED-RK
  Bottom 0.61: IC1.5 32.54,43.18 25.4,43.18 24.61,43.97 R2.1
B2_LED_I
  Bottom 0.61: CON2.9 R4.1
B2_NC3
  Bottom 0.61: CON2.6 14.61,16.83 15.4,16.03 JP10.1
B2_SCL_H  (via drill 0.7)
  Top 0.61: 17.46,20 17.47,20 17.47,17.14 14.62,14.29 CON2.4 | 17.46,20 Q2.3 | 17.46,20 17.46,26.83 v21.43,26.83
  Bottom 0.61: v21.43,26.83 19.37,26.83 R11.2
B2_SCL_L  (via drill 0.7)
  Top 0.61: MOD1.P_SCL 35.72,14.29 37.62,14.29 | 37.62,14.29 39.21,14.29 | 39.21,14.29 39.21,40.8 | 39.21,40.8 v35.88,40.8 | Q2.2 21.59,20.95 R10.2 23.34,20.58 23.34,19.05 v25.56,19.05 | 37.62,14.29 v37.62,13.33 | C18.2 39.21,40.8 | C16.2 41.59,14.29 39.21,14.29
  Bottom 0.61: v35.88,40.8 30,40.8 IC1.14 | v37.62,13.33 37.62,19.05 v25.56,19.05
B2_SDA_H  (via drill 0.7)
  Top 0.61: CON2.2 17.62,11.75 | 17.62,11.75 17.79,11.75 Q1.3 | v16.35,23.18 15.72,23.18 15.72,19.05 v16.03,18.73 | v17.62,14.45 17.62,11.75
  Bottom 0.61: 16.35,28.2 16.35,28.15 | 16.35,28.15 v16.35,23.18 | R9.2 16.35,28.15 | v16.03,18.73 17.62,17.14 v17.62,14.45
B2_SDA_L  (via drill 0.7)
  Top 0.61: MOD1.P_SDA 33.18,11.59 26.67,11.59 | v7.78,35.08 7.14,35.08 7.14,9.68 26.67,9.68 26.67,11.59 | Q1.2 22.38,13.01 R8.2 26.67,12.96 26.67,11.59
  Bottom 0.61: IC1.15 28.73,39.53 15.4,39.53 15.4,35.08 v7.78,35.08
B2_VLHKOMER  (via drill 0.7)
  Top 0.61: CON2.7 8.89,19.37 8.89,30.48 v19.37,30.48
  Bottom 0.61: R6.1 30.32,27.15 AM2302.DATA 30.64,30.48 v19.37,30.48
B3_+3V  (via drill 0.7)
  Top 0.61: C18.1 42.55,34.29 v48.74,34.29
  Top 0.813: v48.74,27.94 v48.74,34.29 | v54.77,26.83 54.95,26.83 C10.1
  Bottom 0.61: R14.2 48.74,48.58 | 48.74,48.58 C22.1 | C21.1 49.37,48.58 48.74,48.58
  Bottom 0.813: 54.93,16.19 C10.1 | R14.2 R12.2 R13.2 v48.74,34.29 | v48.74,27.94 48.74,27.62 IC2.8 54.77,27.62 v54.77,26.83
  Bottom 1.27: 54.93,16.19 54.93,18.26 59.37,18.26 59.37,13.49 61.6,13.49 REG1.2
B3_+5V  (via drill 0.7)
  Top 0.61: K5.1 41.59,19.84 C16.1 | 62.55,41.59 62.55,41.27 C17.2 | C25.1 60.01,41.59
  Top 0.813: 62.55,31.11 v51.28,31.11 51.28,19.84 K5.1 | 62.55,31.11 62.55,41.59 60.01,41.59 JP4.6 | C20.2 67.63,31.11 62.55,31.11
  Bottom 0.813: R15.2 48.58,31.11 v51.28,31.11
  Bottom 1.27: K5.1 63.98,19.84 63.98,16.19 C9.1 | REG1.3 63.96,10.4 C9.1 | C23.2 63.96,17.3 C9.1
B3_GND  (via drill 0.7)
  Top 0.813: C9.2 61.28,16.19
  Top 1.27: C10.2 C9.2 | 61.28,16.19 v61.28,21.59
  Bottom 0.61: C19.2 62.55,34.61
  Bottom 0.813: JP4.8 62.55,39.05 62.55,34.61 62.55,21.59 v61.28,21.59 52.17,21.59 IC2.5 48.26,23.81 R16.1
  Bottom 1.27: 57.45,10.4 52.86,10.4 52.86,4.6 K1.2 | REG1.1 57.45,10.4 | 57.45,10.4 C10.2
B3_KOM_A
  Bottom 0.61: C15.1 44.77,24.45
  Bottom 0.813: R15.1 R17.1 | IC2.6 56.36,25.08 56.36,29.37 R17.1 | R17.1 44.77,29.37 44.77,24.45 44.77,9.68 K1.1
B3_KOM_B
  Bottom 0.813: IC2.7 48.26,26.35 R16.2 46.2,25.88 | R17.2 46.2,27.46 46.2,25.88 | 46.2,25.88 46.2,14.76 K5.2
B3_RS485-RX
  Bottom 0.813: R13.1 JP4.9 53.98,33.02 59.85,33.02 59.85,27.62 IC2.1
B3_RS485-SMER  (via drill 0.7)
  Top 0.61: JP4.5 55.25,40.32 57.94,40.32
  Top 0.813: 57.94,40.32 61.12,40.32 v61.12,34.13
  Bottom 0.813: R14.1 JP4.5 | v61.12,34.13 61.12,25.08 IC2.3 IC2.2
B3_RS485-TX  (via drill 0.7)
  Top 0.813: v60.48,23.49 57.79,23.49 v57.79,29.53 | v52.55,33.81 52.39,33.81 52.39,39.05 JP4.7
  Bottom 0.813: JP4.7 R12.1 | IC2.4 60.48,23.81 v60.48,23.49 | v57.79,29.53 57.79,31.27 52.55,31.27 v52.55,33.81
B4_+5V  (via drill 0.7)
  Top 0.813: JP3.3 ISP.2 | C14.2 90.81,23.65 90.81,20.32 | 90.81,20.32 90.81,14.92 72.71,14.92 K4.1 | v89.69,20.32 90.81,20.32 | C20.1 C13.C+
  Bottom 0.61: C19.1 68.58,34.45 R18.2 | C23.1 K4.1
  Bottom 0.813: JP3.3 JP6.3 R23.2 C11.2 71.44,36.35 R18.2 R19.2 R20.2 71.44,26.67 C13.C+ 72.87,24.13 | 72.87,24.13 C12.2 | 72.87,24.13 72.87,21.75 | 72.87,21.75 72.87,17.3 K4.1 | IC3.8 R21.2 78.26,21.75 72.87,21.75 | IC4.8 90.81,31.9 90.81,20.32 v89.69,20.32
B4_A
  Top 0.813: R24.1 84.3,17.3 K3.1
  Bottom 0.813: IC3.6 80.8,20.32 | 80.8,20.32 R21.1 | 80.8,20.32 82.87,20.32 K3.1
B4_B  (via drill 0.7)
  Top 0.813: v79.53,22.22 79.53,17.3 K4.2 | R22.2 79.53,25.72 v79.53,22.22 | R24.2 79.53,23.49 v79.53,22.22
  Bottom 0.813: IC3.7 v79.53,22.22
B4_GND
  Top 0.61: 76.68,41.43 D2.K D1.K 76.68,54.77 C26.1 | C17.1 68.58,41.43 JP6.1
  Top 0.813: ISP.6 JP3.1 JP6.1 76.68,41.43 74.61,41.43 74.61,26.67 C13.C- | K3.2 87.79,17.3 C14.1 87.79,25.72 R22.1
  Bottom 0.813: C11.1 71.91,41.43 JP6.1 | C13.C- 76.36,26.03 | 76.36,26.03 76.36,24.13 C12.1 | 76.36,26.03 82.07,26.03 IC3.5 85.09,24.07 | IC4.4 85.09,24.07 | 85.09,24.07 85.09,20.48 87.95,20.48 K3.2
BLUE-RX
  Top 0.61: JP1.2 60.64,73.66 BT1.RX
BLUE-TX
  Bottom 0.61: JP1.4 62.39,83.82 62.39,71.12 BT1.TX
BT-ON
  Top 0.61: R7.2 Q3.2
  Bottom 0.61: Q3.2 67.31,87.15 47.94,87.15 47.94,71.6 38.89,71.6 38.89,75.72 U$1.P$27
BT-PWR
  Top 0.61: Q3.3 65.56,80.8
  Top 1.27: 65.56,80.8 65.56,79.37 68.1,79.37 68.1,66.04 BT1.VCC
BZUK
  Top 0.61: C8.2 U$1.P$13
BZUK-C
  Top 0.61: C8.1 55.56,91.92 P1.1
BZUK-DRAIN  (via drill 0.7)
  Top 0.61: v26.04,76.83 26.04,64.45 REP1.- 27.62,55.72 C28.2 | v26.04,87.15 40.32,87.15 40.32,86.2 45.4,86.2 45.4,87.15 56.36,87.15 56.36,88.26 59.85,91.76 59.85,94.77 Q4.2
  Bottom 0.61: v26.04,76.83 v26.04,87.15
BZUK-GATE
  Bottom 0.813: P1.3 60.01,94.77 62.07,94.77 Q4.1
DIS-RX
  Bottom 0.61: CON3.1 29.69,95.57 29.69,70.64 U$1.P$25
DIS-TX
  Bottom 0.61: CON3.5 31.43,100.65 31.43,73.18 U$1.P$26
DS18B20  (via drill 0.7)
  Top 0.61: KON-DS18B20.2 13.97,82.55 | 13.97,82.55 R5.2 | v39.53,70.33 39.53,74.45 30,74.45 30,78.58 13.97,78.58 13.97,82.55
  Bottom 0.61: U$1.P$5 50.17,70.33 v39.53,70.33
DS18B20-PWR
  Top 0.61: KON-DS18B20.3 13.97,87.55 | 13.97,87.55 R5.1 | U$1.P$16 50.17,98.27 46.2,98.27 46.2,104.46 37.62,104.46 37.62,89.69 13.97,89.69 13.97,87.55
I2C-SCL  (via drill 0.7)
  Top 0.61: RAM2.6 v77.63,94.93 78.11,94.93 | RAM1.6 v77.63,101.92 | 56.36,100.65 56.36,93.5 U$1.P$14 46.2,93.5 46.2,92.87 JP5.9 | 56.36,100.65 56.36,105.09 EEPROM.6 | v57.94,100.65 56.36,100.65 | CON1.4 92.87,70.48 79.69,70.48 MOD3.SCL2
  Bottom 0.61: v77.63,101.92 77.63,100.65 | 77.63,100.65 v57.94,100.65 | MOD3.SCL2 MOD2.SCL 79.69,94.93 v77.63,94.93 77.63,100.65
I2C-SDA  (via drill 0.7)
  Top 0.61: RAM1.5 74.45,103.19 v74.45,102.55 v74.45,96.2 RAM2.5 | EEPROM.5 57.94,106.36 | 57.94,106.36 54.93,106.36 54.93,96.2 50.17,96.2 U$1.P$15 44.93,96.04 44.93,100.49 JP5.3 | CON1.2 92.87,67.47 v82.23,67.47 | v57.94,107.95 57.94,106.36
  Bottom 0.61: v74.45,96.2 74.45,85.88 MOD2.SDA 77.15,77.31 72.71,77.31 72.71,67.47 v82.23,67.47 MOD3.SDA2 | v74.45,102.55 57.94,102.55 v57.94,107.95
INFRA  (via drill 0.7)
  Top 0.61: v72.71,82.39 v83.66,82.39
  Bottom 0.305: 94.14,74.45 91.6,74.45
  Bottom 0.61: U$1.P$17 54.93,101.12 54.93,97.47 61.75,97.47 61.75,98.58 72.71,98.58 v72.71,82.39 | v83.66,82.39 90.49,82.39 90.49,74.45 91.6,74.45 | CON1.5 94.14,74.45
INT_POHYB
  Bottom 0.61: U$1.P$1 81.44,60.48 | 81.44,60.48 88.9,60.48 88.9,63.82 97.79,63.82 97.79,70.64 CON1.3 | C27.2 81.44,60.48
  Bottom 0.813: U$1.P$1 50.17,56.67 C21.2
INT_RTC  (via drill 0.7)
  Top 0.61: v77.15,61.75 MOD3.SQW
  Bottom 0.61: U$1.P$2 63.5,63.02 63.5,61.75 v77.15,61.75
KOM-RX
  Top 0.61: JP1.3 56.52,83.82 56.52,75.72 U$1.P$7 47.15,75.72 47.15,84.93 JP2.3
KOM-TX
  Top 0.61: JP1.1 58.1,73.18 U$1.P$6 50.17,73.02 45.4,73.02 45.4,82.39 JP2.2
LED_I
  Top 0.61: CON1.9 97.63,78.26 97.63,63.82 88.9,63.82 88.9,60.48 76.84,60.48 | 76.84,60.48 60.01,60.48 | 60.01,60.48 53.82,60.48 53.82,65.56 U$1.P$3 | C25.2 60.01,60.48 | C26.2 76.84,60.48
MISO  (via drill 0.7)
  Top 0.61: U$1.P$30 v19.69,83.34
  Bottom 0.61: v19.69,83.34 SD1.MISO
MOSI  (via drill 0.7)
  Top 0.61: U$1.P$29 v17.15,80.8
  Bottom 0.61: v17.15,80.8 SD1.MOSI
MOSI-ISP
  Top 0.406: 86.36,42.39 86.36,40.64
  Top 0.61: R26.1 86.36,44.13 86.36,42.39 | 86.36,40.64 86.36,40.16 ISP.4
  Bottom 0.813: IC4.5 83.5,31.9 83.5,38.26 84.14,38.89 ISP.4
N$1  (via drill 0.7)
  Top 0.61: v15.56,46.51 5.56,46.51 5.56,7.3 16.67,7.3 18.57,5.4 21.75,5.4 LED1.K
  Bottom 0.61: 21.59,46.67 R1.2 v15.56,46.51
N$2  (via drill 0.7)
  Top 0.61: v15.56,44.45 15.56,35.24 22.54,35.24 22.54,24.29 LED2.K
  Bottom 0.61: R2.2 21.11,44.45 v15.56,44.45
N$3  (via drill 0.7)
  Top 0.61: v21.11,41.59 23.65,41.59 23.65,21.75 27.15,21.75 27.15,16.03 LED3.K
  Bottom 0.61: R3.2 21.11,41.43 v21.11,41.59
N$4
  Bottom 0.305: 5.87,103.66 30.64,103.66 30.64,110.01 5.87,110.01 5.87,103.66
N$5
  Bottom 0.61: R4.2 10.8,32.07 LED4.K
N$6
  Top 0.61: D2.A R26.2 | R26.2
N$7  (via drill 0.7)
  Top 0.61: v29.05,33.97 24.92,33.97 24.92,23.02 29.37,23.02 SW1.4
  Bottom 0.61: IC1.11 33.81,33.97 v29.05,33.97
N$8
  Top 0.813: RAM2.1 94.62,92.39 C4.1
N$9  (via drill 0.7)
  Top 0.61: v32.54,31.91 26.19,31.91 26.19,24.13 31.91,24.13 SW1.5
  Bottom 0.61: IC1.10 35.08,31.91 v32.54,31.91
N$10  (via drill 0.7)
  Top 0.61: v36.83,32.7 37.78,32.7 37.78,16.83 SW1.6
  Bottom 0.61: IC1.9 36.35,32.7 v36.83,32.7
N$12
  Top 0.813: JP6.2 JP3.2
  Bottom 0.61: SJ-SCL1.2 82.46,39.59 81.76,38.89 JP3.2
  Bottom 0.813: R23.1 74.3,38.89 JP6.2
N$13
  Top 0.61: D1.A R25.1 | R25.1
N$17
  Top 0.813: RAM1.1 94.14,99.38 C1.1
NC1
  Bottom 0.61: U$1.P$8 51.59,78.26 52.86,79.53 JP7.1
NC2
  Bottom 0.61: U$1.P$9 51.59,80.8 52.86,82.07 JP8.1
NC3  (via drill 0.7)
  Top 0.61: v71.28,72.23 71.28,69.06 v75.41,69.06 | v88.74,69.06 v78.58,69.06
  Bottom 0.61: v71.28,72.23 71.28,78.26 63.82,78.26 63.82,85.88 54.29,85.88 JP9.1 53.02,84.61 51.75,83.34 U$1.P$10 | CON1.6 91.44,73.18 90.65,72.39 90.65,69.06 v88.74,69.06 | v78.58,69.06 v75.41,69.06
NC4  (via drill 0.7)
  Top 0.61: v47.78,108.27 v43.97,108.27
  Bottom 0.61: U$1.P$12 47.78,88.42 v47.78,108.27 | v43.97,108.27 43.97,103.03 JP5.1
NC5
  Bottom 0.61: U$1.P$28 36.04,78.26 JP17.1
NC6
  Bottom 0.61: U$1.P$36 36.35,98.58 38.26,100.49 JP5.4
RS485-RX
  Bottom 0.61: U$1.P$33 36.35,90.96 38.26,92.87 JP5.10
RS485-SMER
  Bottom 0.61: U$1.P$35 36.35,96.04 38.26,97.95 JP5.6
RS485-TX
  Bottom 0.61: U$1.P$34 36.35,93.5 38.26,95.41 JP5.8
RST-ISP  (via drill 0.7)
  Top 0.813: ISP.5 90.81,41.43 90.81,29.53 v88.74,29.53
  Bottom 0.813: v88.74,29.53 88.9,29.53 IC4.1
SCK  (via drill 0.7)
  Top 0.61: v17.15,85.88 U$1.P$31
  Bottom 0.61: SD1.SCK 14.61,85.88 v17.15,85.88
SCK-ISP  (via drill 0.7)
  Top 0.61: R25.2 89.22,46.51 v89.22,44.93
  Top 0.813: ISP.3 89.54,38.89 89.54,32.23 86.04,32.23 | 86.04,32.23 v86.04,29.53 | v80.65,32.23 86.04,32.23
  Bottom 0.61: v86.04,29.53 87.63,29.53 IC4.7 | v89.22,44.93 89.22,38.89 ISP.3
  Bottom 0.813: IC3.2 80.17,30.22 | 80.17,30.22 IC3.3 80.65,30.22 v80.65,32.23 | R20.1 73.34,28.42 80.17,28.42 80.17,30.22
SD_CS  (via drill 0.7)
  Top 0.61: v19.84,88.42 U$1.P$32
  Bottom 0.61: SD1.CS 12.07,88.42 v19.84,88.42
SPOJKA
  Bottom 0.61: JP5.2 JP20.1
TINY-PB4
  Bottom 0.813: R18.1 82.07,34.45 IC3.4 82.07,27.94 86.36,27.94 IC4.3
TL1  (via drill 0.7)
  Top 0.813: v87.63,28.1 78.26,28.1 v78.26,32.23
  Bottom 0.813: IC4.2 v87.63,28.1 | v78.26,32.23 78.26,32.38 REFUSE-PB3.1 R19.1
  Bottom 1.016: v78.26,32.23 IC3.1
VCC2-MISO-ISP
  Bottom 0.61: SJ-SCL1.1 83.34,46.51 | 83.34,46.51 90.81,46.51 | C27.1 83.34,46.51
  Bottom 0.813: 90.81,46.51 90.81,36.35 ISP.1 87.47,36.35 87.47,33.97 86.36,33.97 IC4.6
VLHKOMER  (via drill 0.7)
  Top 0.61: U$1.P$11 63.02,85.88 v63.02,89.06 | v70.33,80.17 70.33,77.63 v82.55,77.63 | v87.31,77.63 87.31,77.47 90.01,77.47 90.01,84.3 v97.31,84.3
  Bottom 0.61: v63.02,89.06 63.02,88.74 70.33,88.74 v70.33,80.17 | v82.55,77.63 v87.31,77.63 | v97.31,84.3 97.31,75.72 CON1.7

### Text on the board
Bottom: Astrohodiny / s meteostanici | ver.7
tPlace: EEPROM | Displej | EERAM | N | PWR | DATA | P | TLAK | GND | +5V | BUZZ | http://meteo.AstroMiK.org | 1 | Tx | Vlhkost | Rx | G | D | V | 1 | V | B | V | B | A | G | A | RS485 | G
bPlace: RTC | 1 | 5V | 3V | Tx | Rx | G | Micro SD | Bluetooth | GND | +5V | 1 | C | B | A | V | B | V | B | A | G | A | G
nuzky: ✂ | ✂ | ✂
T_nam_docu: G | S | D